# EAGLE schematic ad060 (EAGLE 5.11)
COPYRIGHT: Copyright 2011. All rights reserved.; DOCUMENT: Beat707; REVISION: B

## Sheet 1 of 9
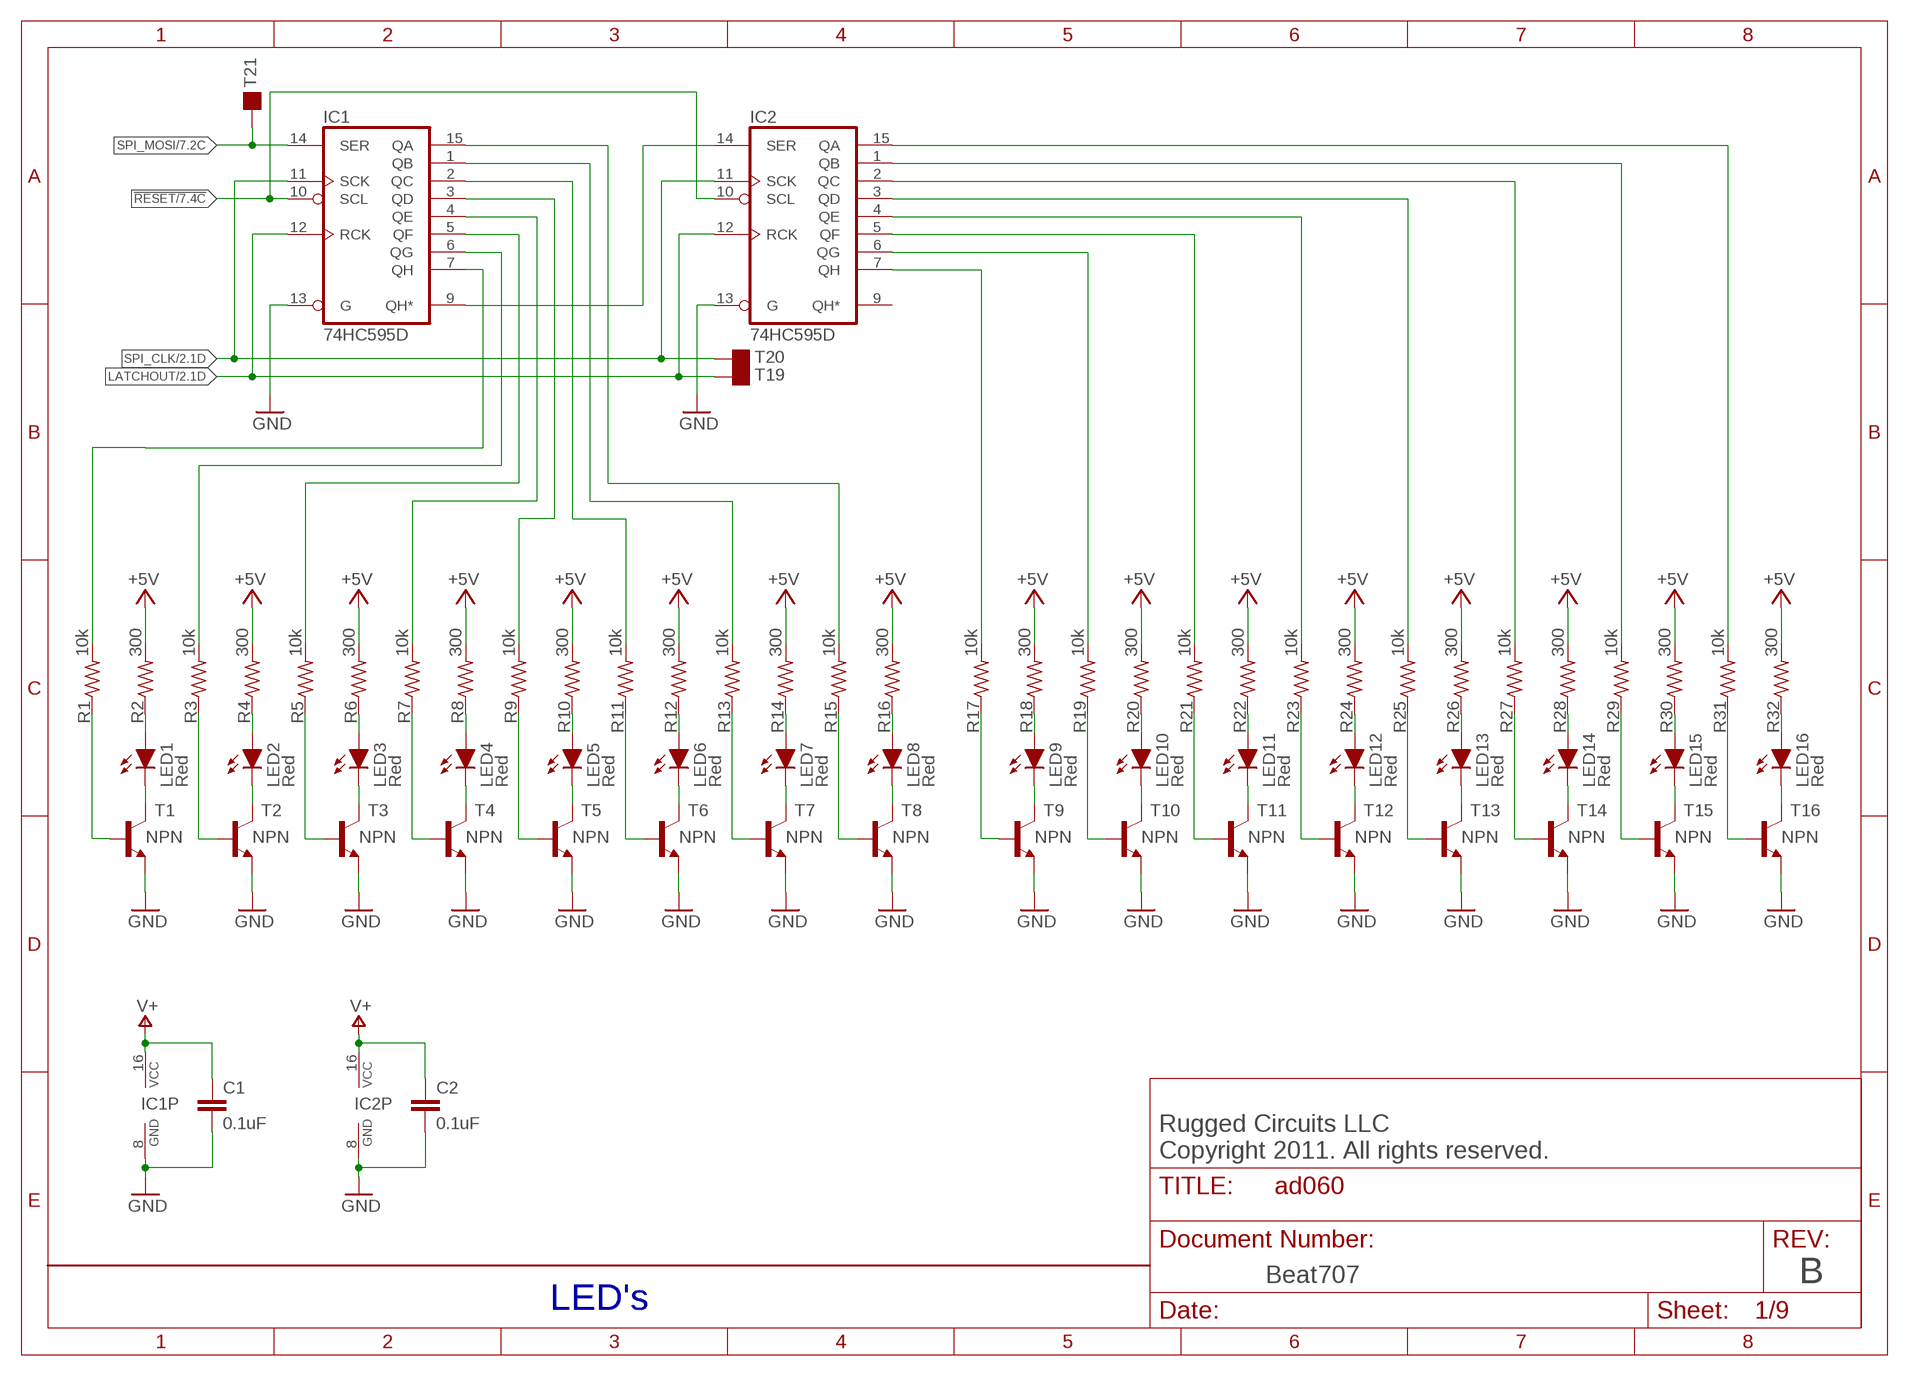
[diagram p0: schematic, sheet 1]

### Parts
C1  0.1uF  C-EUC0805  [C0805]
C2  0.1uF  C-EUC0805  [C0805]
IC1  74HC595D  [SO16]
IC2  74HC595D  [SO16]
LED1  Red  LED1206  [LED1206]
LED2  Red  LED1206  [LED1206]
LED3  Red  LED1206  [LED1206]
LED4  Red  LED1206  [LED1206]
LED5  Red  LED1206  [LED1206]
LED6  Red  LED1206  [LED1206]
LED7  Red  LED1206  [LED1206]
LED8  Red  LED1206  [LED1206]
LED9  Red  LED1206  [LED1206]
LED10  Red  LED1206  [LED1206]
LED11  Red  LED1206  [LED1206]
LED12  Red  LED1206  [LED1206]
LED13  Red  LED1206  [LED1206]
LED14  Red  LED1206  [LED1206]
LED15  Red  LED1206  [LED1206]
LED16  Red  LED1206  [LED1206]
R1  10k  R-US_R0805  [R0805]
R2  300  R-US_R0805  [R0805]
R3  10k  R-US_R0805  [R0805]
R4  300  R-US_R0805  [R0805]
R5  10k  R-US_R0805  [R0805]
R6  300  R-US_R0805  [R0805]
R7  10k  R-US_R0805  [R0805]
R8  300  R-US_R0805  [R0805]
R9  10k  R-US_R0805  [R0805]
R10  300  R-US_R0805  [R0805]
R11  10k  R-US_R0805  [R0805]
R12  300  R-US_R0805  [R0805]
R13  10k  R-US_R0805  [R0805]
R14  300  R-US_R0805  [R0805]
R15  10k  R-US_R0805  [R0805]
R16  300  R-US_R0805  [R0805]
R17  10k  R-US_R0805  [R0805]
R18  300  R-US_R0805  [R0805]
R19  10k  R-US_R0805  [R0805]
R20  300  R-US_R0805  [R0805]
R21  10k  R-US_R0805  [R0805]
R22  300  R-US_R0805  [R0805]
R23  10k  R-US_R0805  [R0805]
R24  300  R-US_R0805  [R0805]
R25  10k  R-US_R0805  [R0805]
R26  300  R-US_R0805  [R0805]
R27  10k  R-US_R0805  [R0805]
R28  300  R-US_R0805  [R0805]
R29  10k  R-US_R0805  [R0805]
R30  300  R-US_R0805  [R0805]
R31  10k  R-US_R0805  [R0805]
R32  300  R-US_R0805  [R0805]
T1  NPN  MMBT4401LT1-NPN-SOT23-BEC  [SOT23-BEC]
T2  NPN  MMBT4401LT1-NPN-SOT23-BEC  [SOT23-BEC]
T3  NPN  MMBT4401LT1-NPN-SOT23-BEC  [SOT23-BEC]
T4  NPN  MMBT4401LT1-NPN-SOT23-BEC  [SOT23-BEC]
T5  NPN  MMBT4401LT1-NPN-SOT23-BEC  [SOT23-BEC]
T6  NPN  MMBT4401LT1-NPN-SOT23-BEC  [SOT23-BEC]
T7  NPN  MMBT4401LT1-NPN-SOT23-BEC  [SOT23-BEC]
T8  NPN  MMBT4401LT1-NPN-SOT23-BEC  [SOT23-BEC]
T9  NPN  MMBT4401LT1-NPN-SOT23-BEC  [SOT23-BEC]
T10  NPN  MMBT4401LT1-NPN-SOT23-BEC  [SOT23-BEC]
T11  NPN  MMBT4401LT1-NPN-SOT23-BEC  [SOT23-BEC]
T12  NPN  MMBT4401LT1-NPN-SOT23-BEC  [SOT23-BEC]
T13  NPN  MMBT4401LT1-NPN-SOT23-BEC  [SOT23-BEC]
T14  NPN  MMBT4401LT1-NPN-SOT23-BEC  [SOT23-BEC]
T15  NPN  MMBT4401LT1-NPN-SOT23-BEC  [SOT23-BEC]
T16  NPN  MMBT4401LT1-NPN-SOT23-BEC  [SOT23-BEC]
T19  TESTPOINT40  [TP40MIL]
T20  TESTPOINT40  [TP40MIL]
T21  TESTPOINT40  [TP40MIL]

### Nets
!RESET: IC1.10(SCL) IC2.10(SCL) ; also sheet 7,9
+5V: R2.2 R4.2 R6.2 R8.2 R10.2 R12.2 R14.2 R16.2 R18.2 R20.2 R22.2 R24.2 R26.2 R28.2 R30.2 R32.2 ; also sheet 5,7,9
GND: C1.2 C2.2 IC1.8(GND) IC1.13(G) IC2.8(GND) IC2.13(G) T1.E T2.E T3.E T4.E T5.E T6.E T7.E T8.E T9.E T10.E T11.E T12.E T13.E T14.E T15.E T16.E ; also sheet 2,3,4,5,6,7,8,9
LATCHOUT: IC1.12(RCK) IC2.12(RCK) T19.1 ; also sheet 2,3,9
N$1: IC1.9(QH*) IC2.14(SER)
N$3: LED1.A R2.1
N$4: LED1.K T1.C
N$5: LED2.A R4.1
N$6: LED2.K T2.C
N$7: IC1.7(QH) R1.2
N$8: IC1.6(QG) R3.2
N$9: R3.1 T2.B
N$12: R1.1 T1.B
N$14: LED3.A R6.1
N$31: LED3.K T3.C
N$32: R5.1 T3.B
N$38: LED4.A R8.1
N$39: LED4.K T4.C
N$40: R7.1 T4.B
N$55: LED5.A R10.1
N$56: LED5.K T5.C
N$57: R9.1 T5.B
N$58: LED6.A R12.1
N$59: LED6.K T6.C
N$60: R11.1 T6.B
N$61: LED7.A R14.1
N$62: LED7.K T7.C
N$63: R13.1 T7.B
N$64: LED8.A R16.1
N$65: LED8.K T8.C
N$66: R15.1 T8.B
N$67: LED9.A R18.1
N$68: LED9.K T9.C
N$69: LED10.A R20.1
N$70: LED10.K T10.C
N$71: R17.1 T9.B
N$72: R19.1 T10.B
N$73: LED11.A R22.1
N$74: LED11.K T11.C
N$75: R21.1 T11.B
N$76: LED12.A R24.1
N$77: LED12.K T12.C
N$78: R23.1 T12.B
N$79: LED13.A R26.1
N$80: LED13.K T13.C
N$81: R25.1 T13.B
N$82: LED14.A R28.1
N$83: LED14.K T14.C
N$84: R27.1 T14.B
N$85: LED15.A R30.1
N$86: LED15.K T15.C
N$87: R29.1 T15.B
N$88: LED16.A R32.1
N$89: LED16.K T16.C
N$90: R31.1 T16.B
N$91: IC1.5(QF) R5.2
N$92: IC1.4(QE) R7.2
N$93: IC1.3(QD) R9.2
N$94: IC1.2(QC) R11.2
N$95: IC1.1(QB) R13.2
N$96: IC1.15(QA) R15.2
N$97: IC2.7(QH) R17.2
N$98: IC2.6(QG) R19.2
N$99: IC2.5(QF) R21.2
N$100: IC2.4(QE) R23.2
N$101: IC2.3(QD) R25.2
N$102: IC2.2(QC) R27.2
N$103: IC2.1(QB) R29.2
N$104: IC2.15(QA) R31.2
SPI_CLK: IC1.11(SCK) IC2.11(SCK) T20.1 ; also sheet 2,3,7,8,9
SPI_MOSI: IC1.14(SER) T21.1 ; also sheet 7,8,9
V+: C1.1 C2.1 IC1.16(VCC) IC2.16(VCC) ; also sheet 2,3,4,6,7,8,9
Unconnected: IC2.9(QH*)

### Notes on the sheet
- Rugged Circuits LLC
- LED's

## Sheet 2 of 9
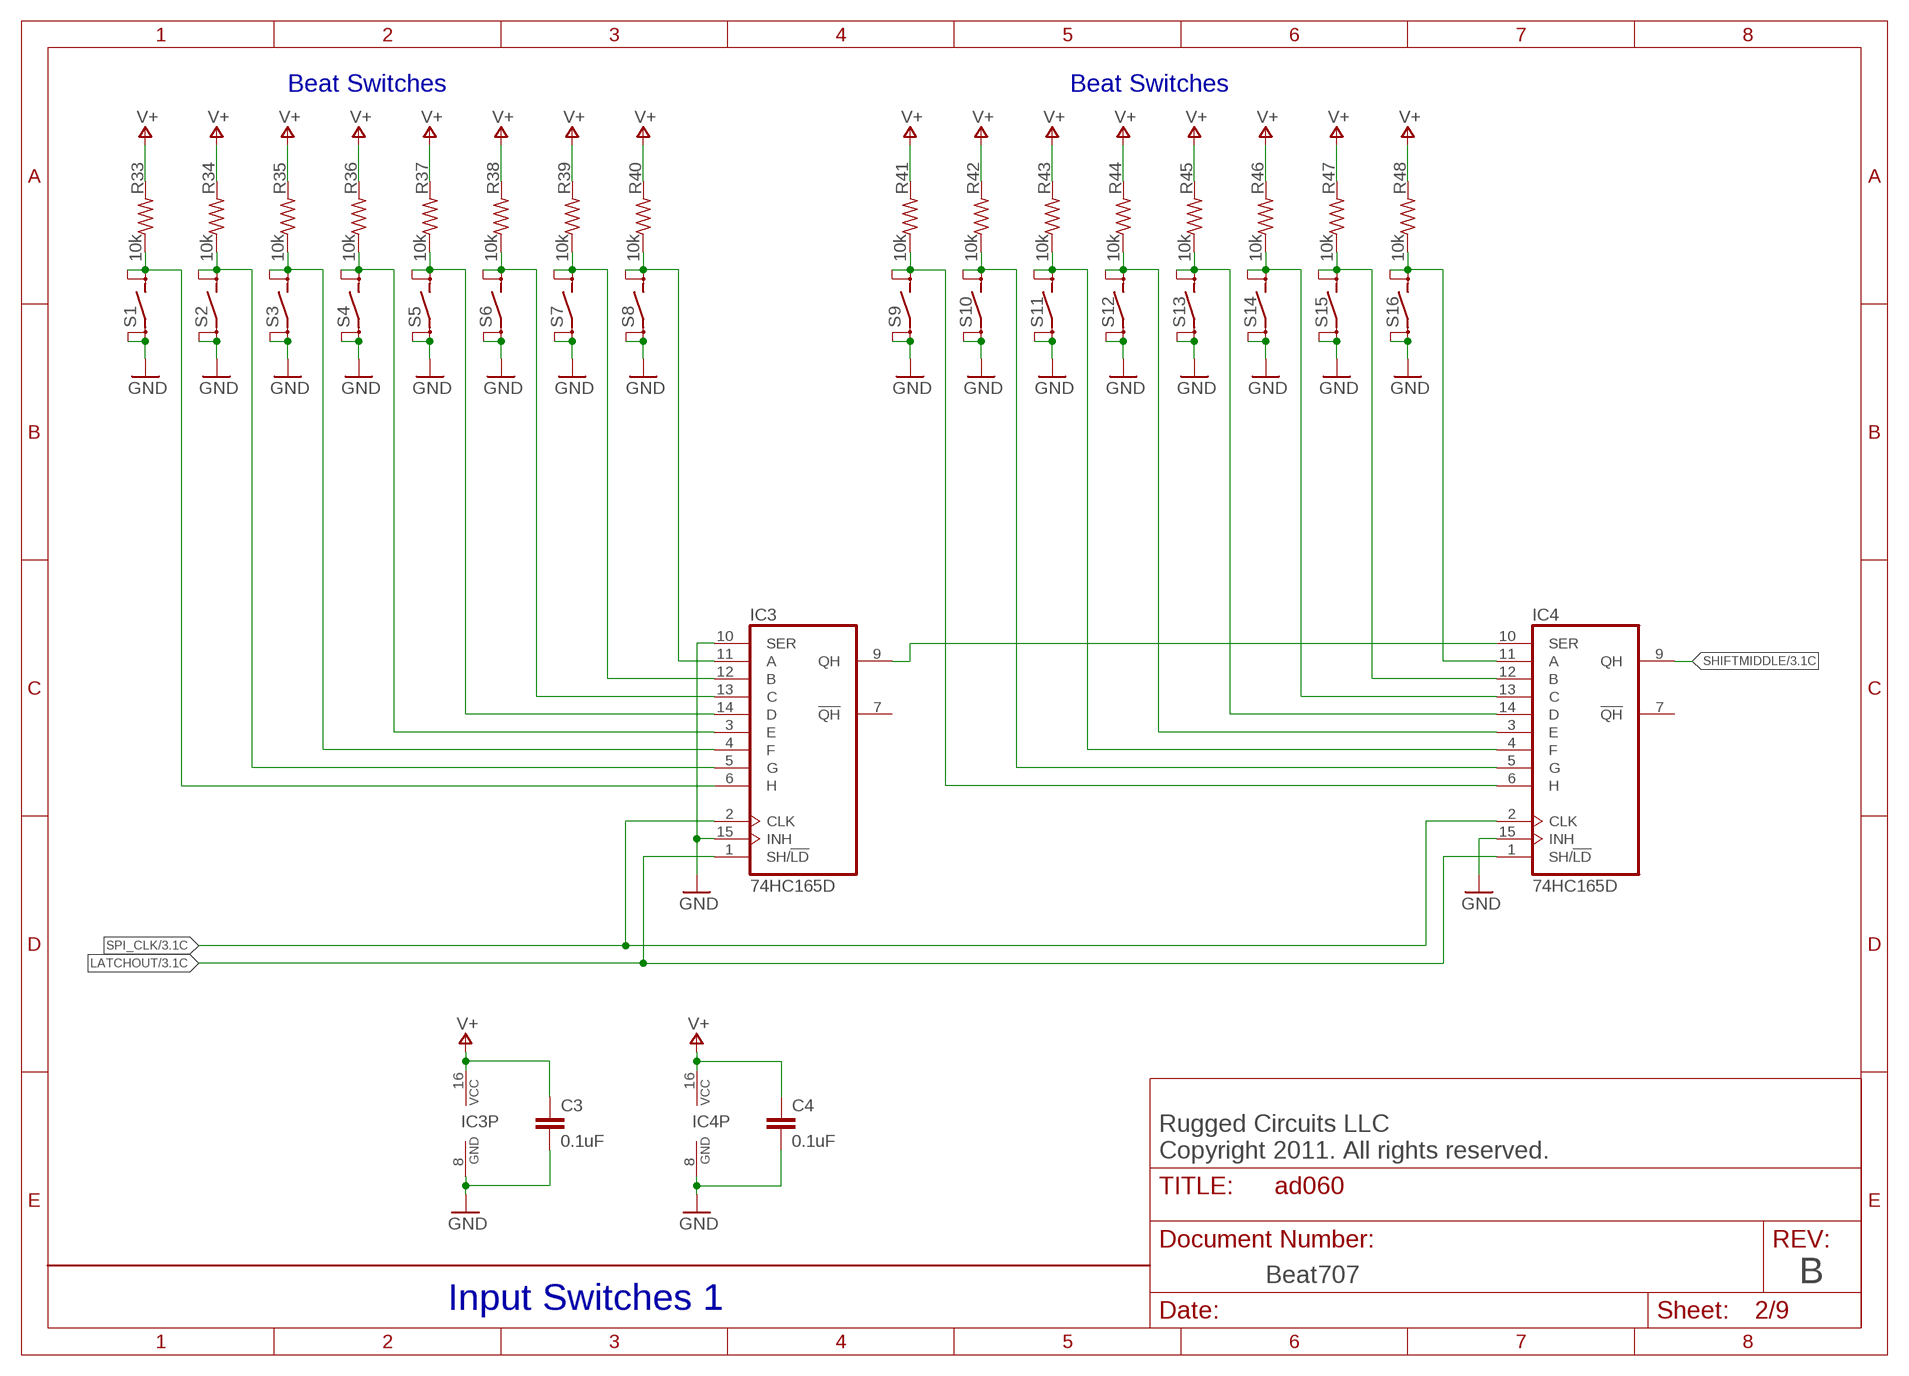
[diagram p1: schematic, sheet 2]

### Parts
C3  0.1uF  C-EUC0805  [C0805]
C4  0.1uF  C-EUC0805  [C0805]
IC3  74HC165D  [SO16]
IC4  74HC165D  [SO16]
R33  10k  R-US_R0805  [R0805]
R34  10k  R-US_R0805  [R0805]
R35  10k  R-US_R0805  [R0805]
R36  10k  R-US_R0805  [R0805]
R37  10k  R-US_R0805  [R0805]
R38  10k  R-US_R0805  [R0805]
R39  10k  R-US_R0805  [R0805]
R40  10k  R-US_R0805  [R0805]
R41  10k  R-US_R0805  [R0805]
R42  10k  R-US_R0805  [R0805]
R43  10k  R-US_R0805  [R0805]
R44  10k  R-US_R0805  [R0805]
R45  10k  R-US_R0805  [R0805]
R46  10k  R-US_R0805  [R0805]
R47  10k  R-US_R0805  [R0805]
R48  10k  R-US_R0805  [R0805]
S1  SPST2CONTACTTL1100F160Q  [TL1100F160Q]
S2  SPST2CONTACTTL1100F160Q  [TL1100F160Q]
S3  SPST2CONTACTTL1100F160Q  [TL1100F160Q]
S4  SPST2CONTACTTL1100F160Q  [TL1100F160Q]
S5  SPST2CONTACTTL1100F160Q  [TL1100F160Q]
S6  SPST2CONTACTTL1100F160Q  [TL1100F160Q]
S7  SPST2CONTACTTL1100F160Q  [TL1100F160Q]
S8  SPST2CONTACTTL1100F160Q  [TL1100F160Q]
S9  SPST2CONTACTTL1100F160Q  [TL1100F160Q]
S10  SPST2CONTACTTL1100F160Q  [TL1100F160Q]
S11  SPST2CONTACTTL1100F160Q  [TL1100F160Q]
S12  SPST2CONTACTTL1100F160Q  [TL1100F160Q]
S13  SPST2CONTACTTL1100F160Q  [TL1100F160Q]
S14  SPST2CONTACTTL1100F160Q  [TL1100F160Q]
S15  SPST2CONTACTTL1100F160Q  [TL1100F160Q]
S16  SPST2CONTACTTL1100F160Q  [TL1100F160Q]

### Nets
GND: C3.2 C4.2 IC3.8(GND) IC3.10(SER) IC3.15(INH) IC4.8(GND) IC4.15(INH) S1.1(A1) S1.2(A2) S2.1(A1) S2.2(A2) S3.1(A1) S3.2(A2) S4.1(A1) S4.2(A2) S5.1(A1) S5.2(A2) S6.1(A1) S6.2(A2) S7.1(A1) S7.2(A2) S8.1(A1) S8.2(A2) S9.1(A1) S9.2(A2) S10.1(A1) S10.2(A2) S11.1(A1) S11.2(A2) S12.1(A1) S12.2(A2) S13.1(A1) S13.2(A2) S14.1(A1) S14.2(A2) S15.1(A1) S15.2(A2) S16.1(A1) S16.2(A2) ; also sheet 1,3,4,5,6,7,8,9
LATCHOUT: IC3.1(SH/!LD) IC4.1(SH/!LD) ; also sheet 1,3,9
N$16: IC3.9(QH) IC4.10(SER)
N$22: IC3.6(H) R33.1 S1.3(B1) S1.4(B2)
N$24: IC3.5(G) R34.1 S2.3(B1) S2.4(B2)
N$26: IC3.4(F) R35.1 S3.3(B1) S3.4(B2)
N$28: IC3.3(E) R36.1 S4.3(B1) S4.4(B2)
N$30: IC3.14(D) R37.1 S5.3(B1) S5.4(B2)
N$33: IC3.13(C) R38.1 S6.3(B1) S6.4(B2)
N$34: IC3.12(B) R39.1 S7.3(B1) S7.4(B2)
N$35: IC4.6(H) R41.1 S9.3(B1) S9.4(B2)
N$36: IC4.5(G) R42.1 S10.3(B1) S10.4(B2)
N$43: IC4.4(F) R43.1 S11.3(B1) S11.4(B2)
N$44: IC3.11(A) R40.1 S8.3(B1) S8.4(B2)
N$45: IC4.3(E) R44.1 S12.3(B1) S12.4(B2)
N$46: IC4.14(D) R45.1 S13.3(B1) S13.4(B2)
N$47: IC4.13(C) R46.1 S14.3(B1) S14.4(B2)
N$48: IC4.12(B) R47.1 S15.3(B1) S15.4(B2)
N$49: IC4.11(A) R48.1 S16.3(B1) S16.4(B2)
SHIFTMIDDLE: IC4.9(QH) ; also sheet 3
SPI_CLK: IC3.2(CLK) IC4.2(CLK) ; also sheet 1,3,7,8,9
V+: C3.1 C4.1 IC3.16(VCC) IC4.16(VCC) R33.2 R34.2 R35.2 R36.2 R37.2 R38.2 R39.2 R40.2 R41.2 R42.2 R43.2 R44.2 R45.2 R46.2 R47.2 R48.2 ; also sheet 1,3,4,6,7,8,9
Unconnected: IC3.7(!QH) IC4.7(!QH)

### Notes on the sheet
- Beat Switches | Beat Switches
- Rugged Circuits LLC
- Input Switches 1

## Sheet 3 of 9
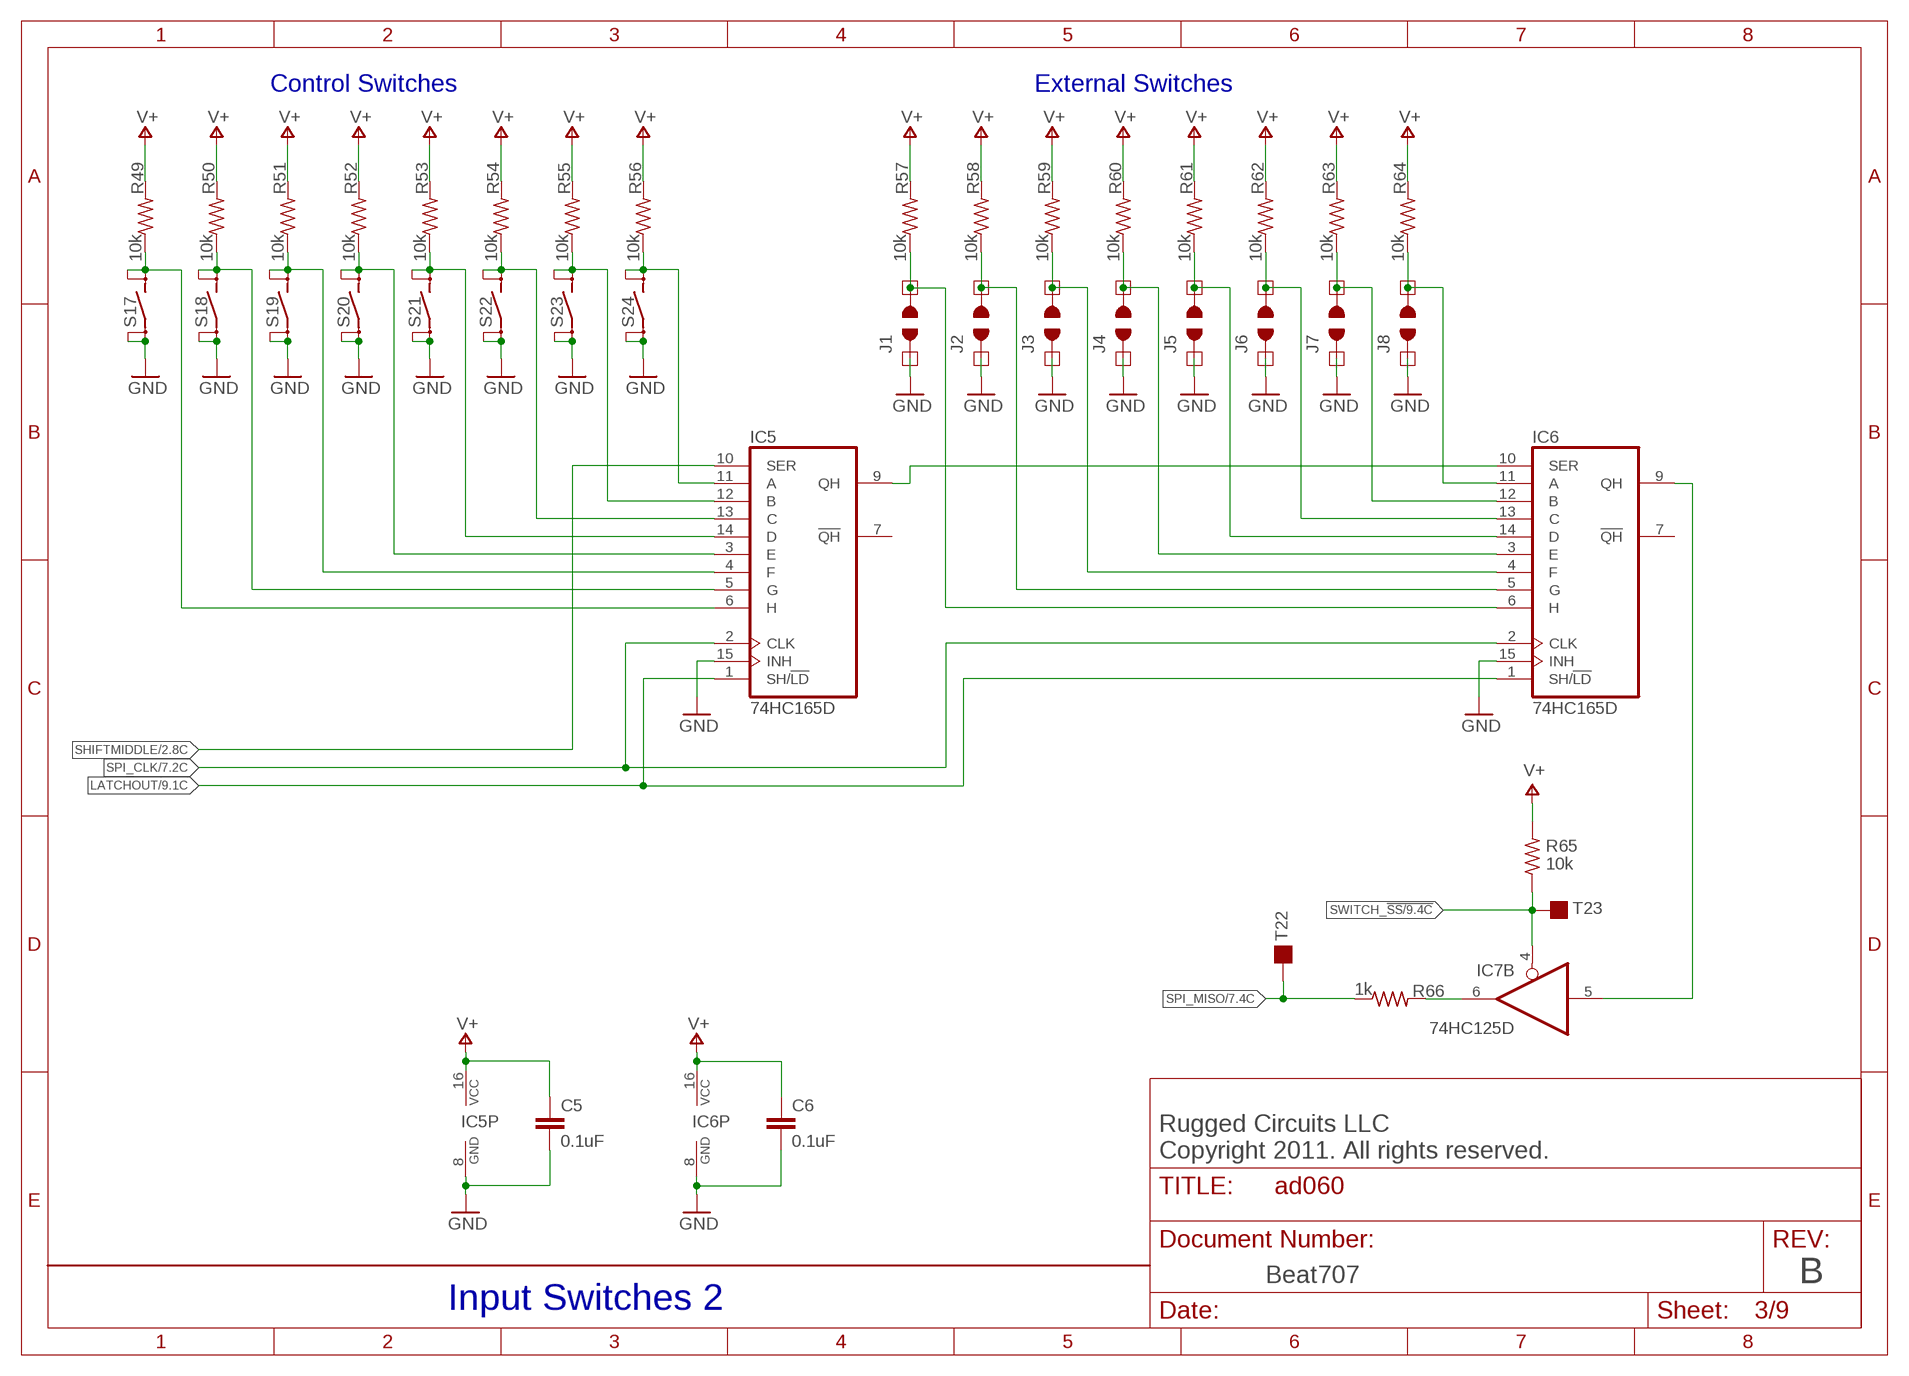
[diagram p2: schematic, sheet 3]

### Parts
C5  0.1uF  C-EUC0805  [C0805]
C6  0.1uF  C-EUC0805  [C0805]
IC5  74HC165D  [SO16]
IC6  74HC165D  [SO16]
IC7  74HC125D  [SO14]
J1  JP2NO  [JP2NO]
J2  JP2NO  [JP2NO]
J3  JP2NO  [JP2NO]
J4  JP2NO  [JP2NO]
J5  JP2NO  [JP2NO]
J6  JP2NO  [JP2NO]
J7  JP2NO  [JP2NO]
J8  JP2NO  [JP2NO]
R49  10k  R-US_R0805  [R0805]
R50  10k  R-US_R0805  [R0805]
R51  10k  R-US_R0805  [R0805]
R52  10k  R-US_R0805  [R0805]
R53  10k  R-US_R0805  [R0805]
R54  10k  R-US_R0805  [R0805]
R55  10k  R-US_R0805  [R0805]
R56  10k  R-US_R0805  [R0805]
R57  10k  R-US_R0805  [R0805]
R58  10k  R-US_R0805  [R0805]
R59  10k  R-US_R0805  [R0805]
R60  10k  R-US_R0805  [R0805]
R61  10k  R-US_R0805  [R0805]
R62  10k  R-US_R0805  [R0805]
R63  10k  R-US_R0805  [R0805]
R64  10k  R-US_R0805  [R0805]
R65  10k  R-US_R0805  [R0805]
R66  1k  R-US_R0805  [R0805]
S17  SPST2CONTACTTL1100F160Q  [TL1100F160Q]
S18  SPST2CONTACTTL1100F160Q  [TL1100F160Q]
S19  SPST2CONTACTTL1100F160Q  [TL1100F160Q]
S20  SPST2CONTACTTL1100F160Q  [TL1100F160Q]
S21  SPST2CONTACTTL1100F160Q  [TL1100F160Q]
S22  SPST2CONTACTTL1100F160Q  [TL1100F160Q]
S23  SPST2CONTACTTL1100F160Q  [TL1100F160Q]
S24  SPST2CONTACTTL1100F160Q  [TL1100F160Q]
T22  TESTPOINT40  [TP40MIL]
T23  TESTPOINT40  [TP40MIL]

### Nets
GND: C5.2 C6.2 IC5.8(GND) IC5.15(INH) IC6.8(GND) IC6.15(INH) J1.1 J2.1 J3.1 J4.1 J5.1 J6.1 J7.1 J8.1 S17.1(A1) S17.2(A2) S18.1(A1) S18.2(A2) S19.1(A1) S19.2(A2) S20.1(A1) S20.2(A2) S21.1(A1) S21.2(A2) S22.1(A1) S22.2(A2) S23.1(A1) S23.2(A2) S24.1(A1) S24.2(A2) ; also sheet 1,2,4,5,6,7,8,9
LATCHOUT: IC5.1(SH/!LD) IC6.1(SH/!LD) ; also sheet 1,2,9
N$17: IC5.9(QH) IC6.10(SER)
N$20: IC5.6(H) R49.1 S17.3(B1) S17.4(B2)
N$50: IC5.5(G) R50.1 S18.3(B1) S18.4(B2)
N$51: IC5.4(F) R51.1 S19.3(B1) S19.4(B2)
N$52: IC5.3(E) R52.1 S20.3(B1) S20.4(B2)
N$53: IC5.14(D) R53.1 S21.3(B1) S21.4(B2)
N$54: IC5.13(C) R54.1 S22.3(B1) S22.4(B2)
N$105: IC5.12(B) R55.1 S23.3(B1) S23.4(B2)
N$106: IC5.11(A) R56.1 S24.3(B1) S24.4(B2)
N$107: IC6.6(H) J1.2 R57.1
N$108: IC6.5(G) J2.2 R58.1
N$109: IC6.4(F) J3.2 R59.1
N$110: IC6.3(E) J4.2 R60.1
N$111: IC6.14(D) J5.2 R61.1
N$112: IC6.13(C) J6.2 R62.1
N$113: IC6.12(B) J7.2 R63.1
N$114: IC6.11(A) J8.2 R64.1
N$158: IC7.6(B:O) R66.2
N$159: IC6.9(QH) IC7.5(B:I)
SHIFTMIDDLE: IC5.10(SER) ; also sheet 2
SPI_CLK: IC5.2(CLK) IC6.2(CLK) ; also sheet 1,2,7,8,9
SPI_MISO: R66.1 T22.1 ; also sheet 7,8,9
SWITCH_!SS: IC7.4(B:OE) R65.1 T23.1 ; also sheet 9
V+: C5.1 C6.1 IC5.16(VCC) IC6.16(VCC) R49.2 R50.2 R51.2 R52.2 R53.2 R54.2 R55.2 R56.2 R57.2 R58.2 R59.2 R60.2 R61.2 R62.2 R63.2 R64.2 R65.2 ; also sheet 1,2,4,6,7,8,9
Unconnected: IC5.7(!QH) IC6.7(!QH)

### Notes on the sheet
- Control Switches | External Switches
- Rugged Circuits LLC
- Input Switches 2

## Sheet 4 of 9
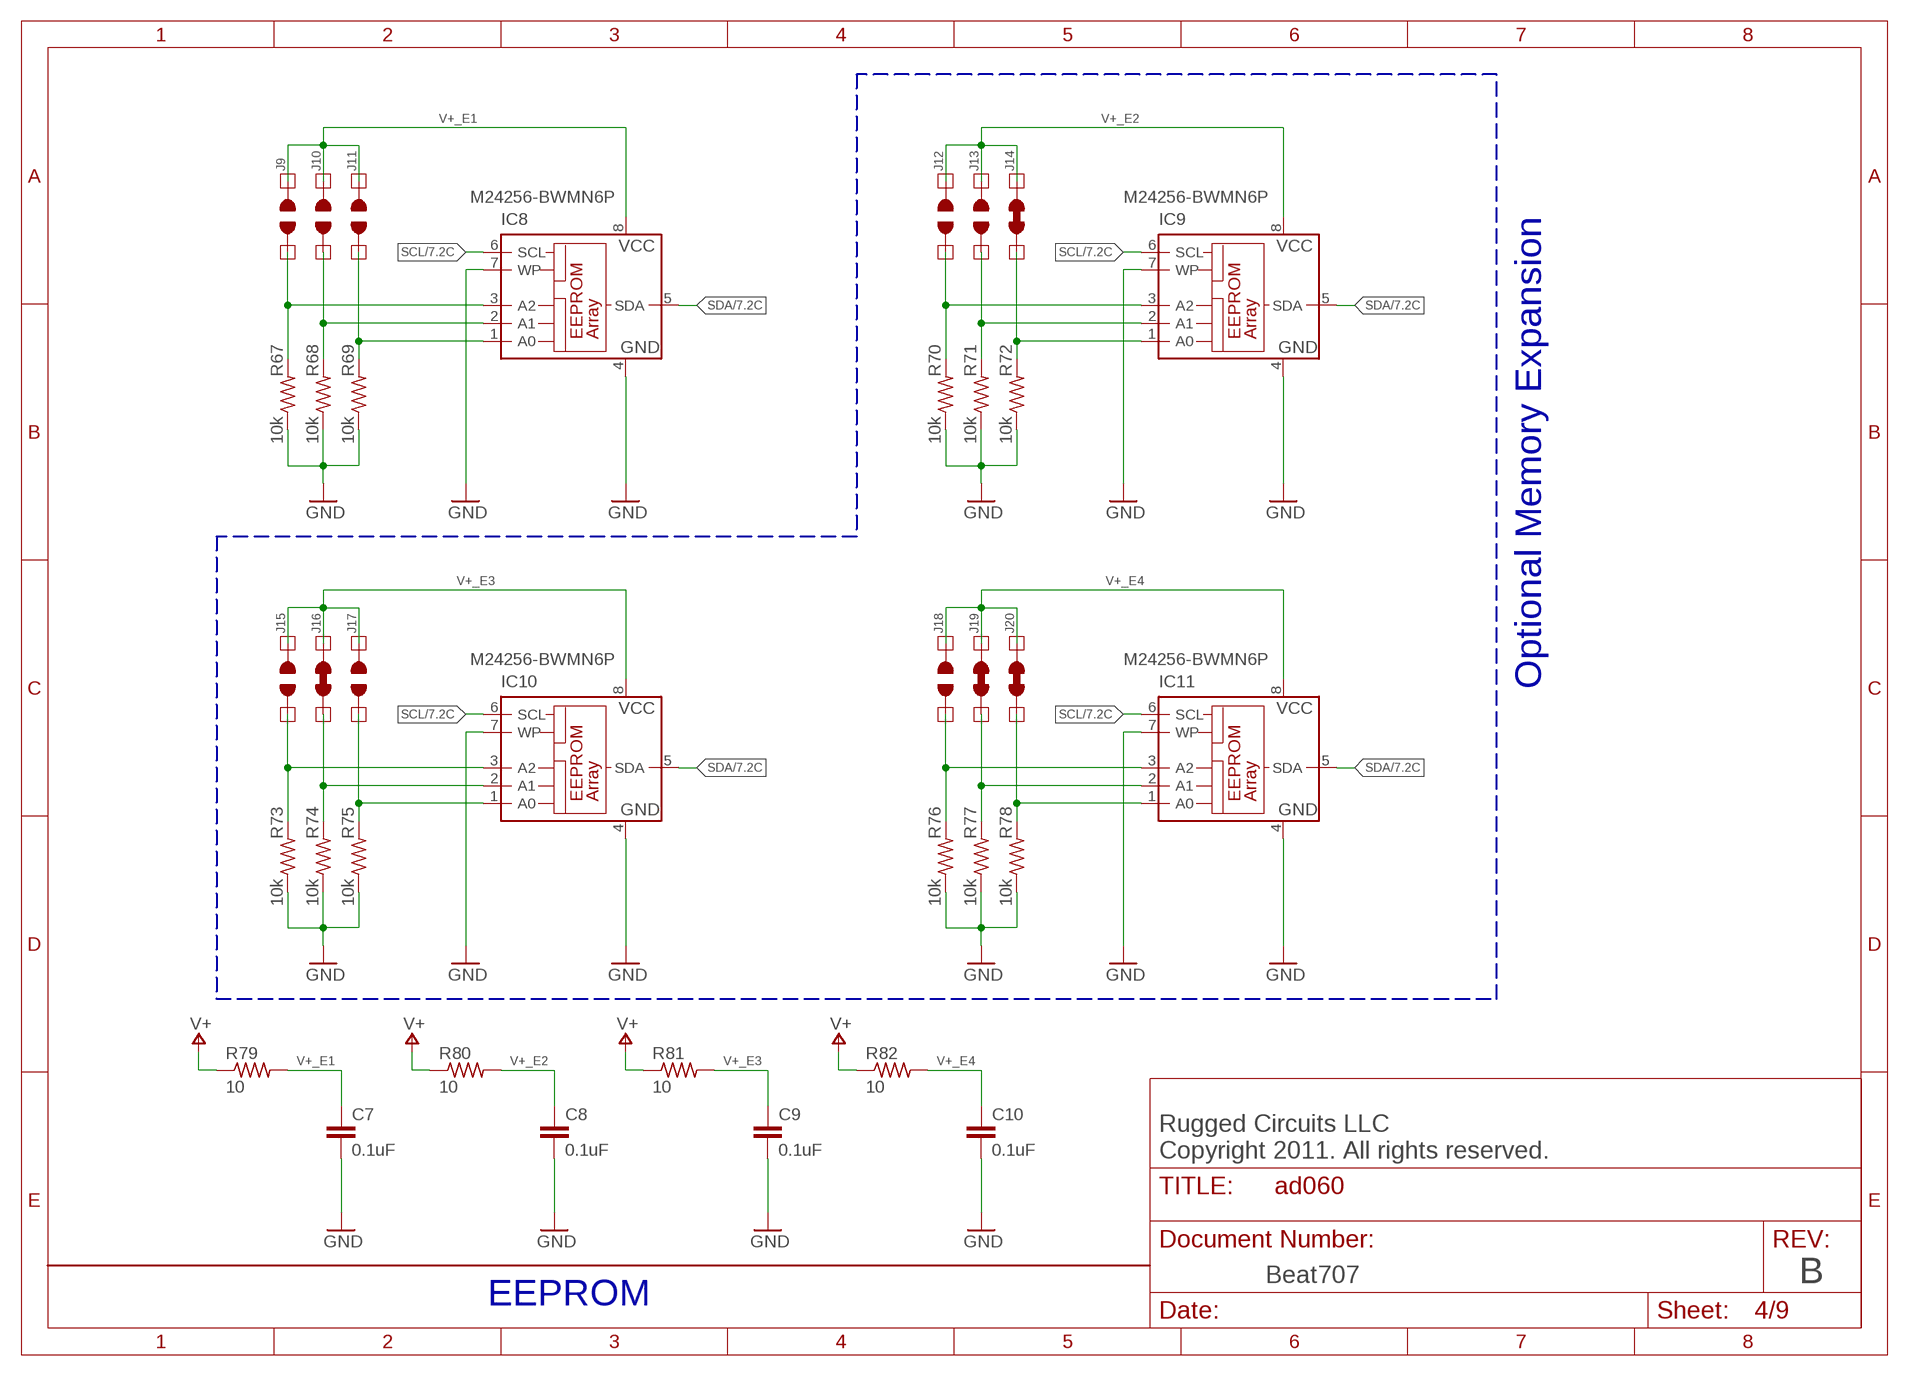
[diagram p3: schematic, sheet 4]

### Parts
C7  0.1uF  C-EUC0805  [C0805]
C8  0.1uF  C-EUC0805  [C0805]
C9  0.1uF  C-EUC0805  [C0805]
C10  0.1uF  C-EUC0805  [C0805]
IC8  M24256-BWMN6P  24LC256SN  [SO-08]
IC9  M24256-BWMN6P  24LC256SN  [SO-08]
IC10  M24256-BWMN6P  24LC256SN  [SO-08]
IC11  M24256-BWMN6P  24LC256SN  [SO-08]
J9  JP2NO  [JP2NO]
J10  JP2NO  [JP2NO]
J11  JP2NO  [JP2NO]
J12  JP2NO  [JP2NO]
J13  JP2NO  [JP2NO]
J14  JP2NC  [JP2NC]
J15  JP2NO  [JP2NO]
J16  JP2NC  [JP2NC]
J17  JP2NO  [JP2NO]
J18  JP2NO  [JP2NO]
J19  JP2NC  [JP2NC]
J20  JP2NC  [JP2NC]
R67  10k  R-US_R0805  [R0805]
R68  10k  R-US_R0805  [R0805]
R69  10k  R-US_R0805  [R0805]
R70  10k  R-US_R0805  [R0805]
R71  10k  R-US_R0805  [R0805]
R72  10k  R-US_R0805  [R0805]
R73  10k  R-US_R0805  [R0805]
R74  10k  R-US_R0805  [R0805]
R75  10k  R-US_R0805  [R0805]
R76  10k  R-US_R0805  [R0805]
R77  10k  R-US_R0805  [R0805]
R78  10k  R-US_R0805  [R0805]
R79  10  R-US_R0805  [R0805]
R80  10  R-US_R0805  [R0805]
R81  10  R-US_R0805  [R0805]
R82  10  R-US_R0805  [R0805]

### Nets
GND: C7.2 C8.2 C9.2 C10.2 IC8.4(GND) IC8.7(WP) IC9.4(GND) IC9.7(WP) IC10.4(GND) IC10.7(WP) IC11.4(GND) IC11.7(WP) R67.1 R68.1 R69.1 R70.1 R71.1 R72.1 R73.1 R74.1 R75.1 R76.1 R77.1 R78.1 ; also sheet 1,2,3,5,6,7,8,9
N$37: IC8.1(A0) J11.1 R69.2
N$41: IC8.2(A1) J10.1 R68.2
N$42: IC8.3(A2) J9.1 R67.2
N$118: IC9.1(A0) J14.1 R72.2
N$119: IC9.2(A1) J13.1 R71.2
N$120: IC9.3(A2) J12.1 R70.2
N$121: IC10.1(A0) J17.1 R75.2
N$122: IC10.2(A1) J16.1 R74.2
N$123: IC10.3(A2) J15.1 R73.2
N$124: IC11.1(A0) J20.1 R78.2
N$125: IC11.2(A1) J19.1 R77.2
N$126: IC11.3(A2) J18.1 R76.2
SCL: IC8.6(SCL) IC9.6(SCL) IC10.6(SCL) IC11.6(SCL) ; also sheet 7,9
SDA: IC8.5(SDA) IC9.5(SDA) IC10.5(SDA) IC11.5(SDA) ; also sheet 7,9
V+: R79.1 R80.1 R81.1 R82.1 ; also sheet 1,2,3,6,7,8,9
V+_E1: C7.1 IC8.8(VCC) J9.2 J10.2 J11.2 R79.2
V+_E2: C8.1 IC9.8(VCC) J12.2 J13.2 J14.2 R80.2
V+_E3: C9.1 IC10.8(VCC) J15.2 J16.2 J17.2 R81.2
V+_E4: C10.1 IC11.8(VCC) J18.2 J19.2 J20.2 R82.2

### Notes on the sheet
- Optional Memory Expansion
- Rugged Circuits LLC
- EEPROM

## Sheet 5 of 9
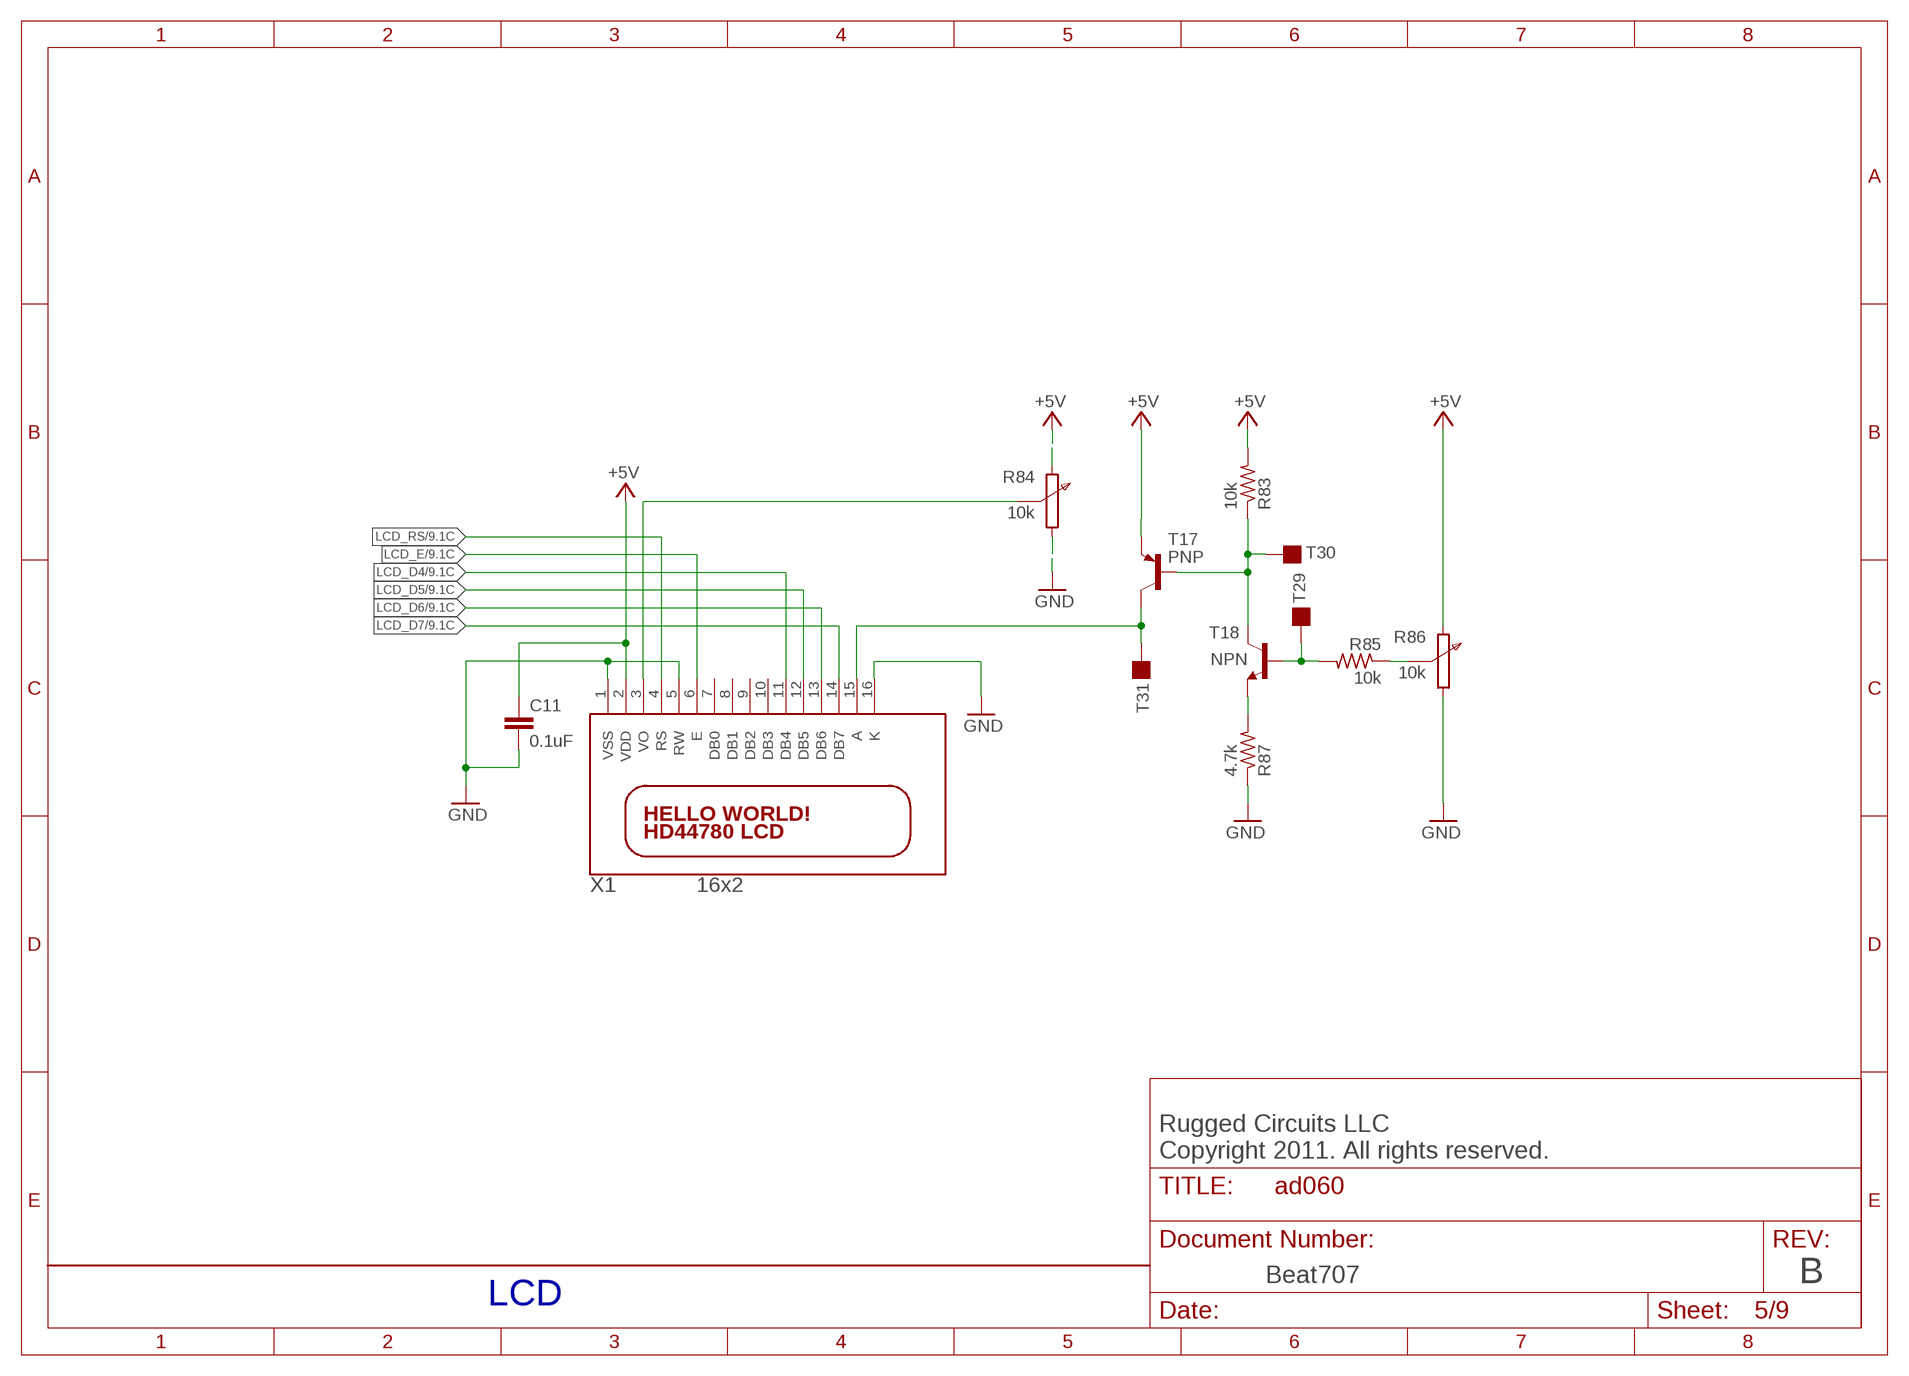
[diagram p4: schematic, sheet 5]

### Parts
C11  0.1uF  C-EUC0805  [C0805]
R83  10k  R-US_R0805  [R0805]
R84  10k  POTEVND8A  [EVND8A]
R85  10k  R-US_R0805  [R0805]
R86  10k  POTEVND8A  [EVND8A]
R87  4.7k  R-US_R0805  [R0805]
T17  PNP  MMBT2907ALT1-PNP-SOT23-BEC  [SOT23-BEC]
T18  NPN  MMBT4401LT1-NPN-SOT23-BEC  [SOT23-BEC]
T29  TESTPOINT40  [TP40MIL]
T30  TESTPOINT40  [TP40MIL]
T31  TESTPOINT40  [TP40MIL]
X1  16x2  HD44780LCD-1602  [LCD1602]

### Nets
+5V: C11.1 R83.2 R84.3(B) R86.3(B) T17.E X1.2(VDD) ; also sheet 1,7,9
GND: C11.2 R84.1(A) R86.1(A) R87.1 X1.1(VSS) X1.5(RW) X1.16(K) ; also sheet 1,2,3,4,6,7,8,9
LCD_D4: X1.11(DB4) ; also sheet 9
LCD_D5: X1.12(DB5) ; also sheet 9
LCD_D6: X1.13(DB6) ; also sheet 9
LCD_D7: X1.14(DB7) ; also sheet 9
LCD_E: X1.6(E) ; also sheet 9
LCD_RS: X1.4(RS) ; also sheet 9
N$115: R84.2(W) X1.3(VO)
N$117: T17.C T31.1 X1.15(A)
N$127: R83.1 T17.B T18.C T30.1
N$129: R87.2 T18.E
N$130: R85.1 R86.2(W)
N$131: R85.2 T18.B T29.1
Unconnected: X1.7(DB0) X1.8(DB1) X1.9(DB2) X1.10(DB3)

### Notes on the sheet
- Rugged Circuits LLC
- LCD

## Sheet 6 of 9
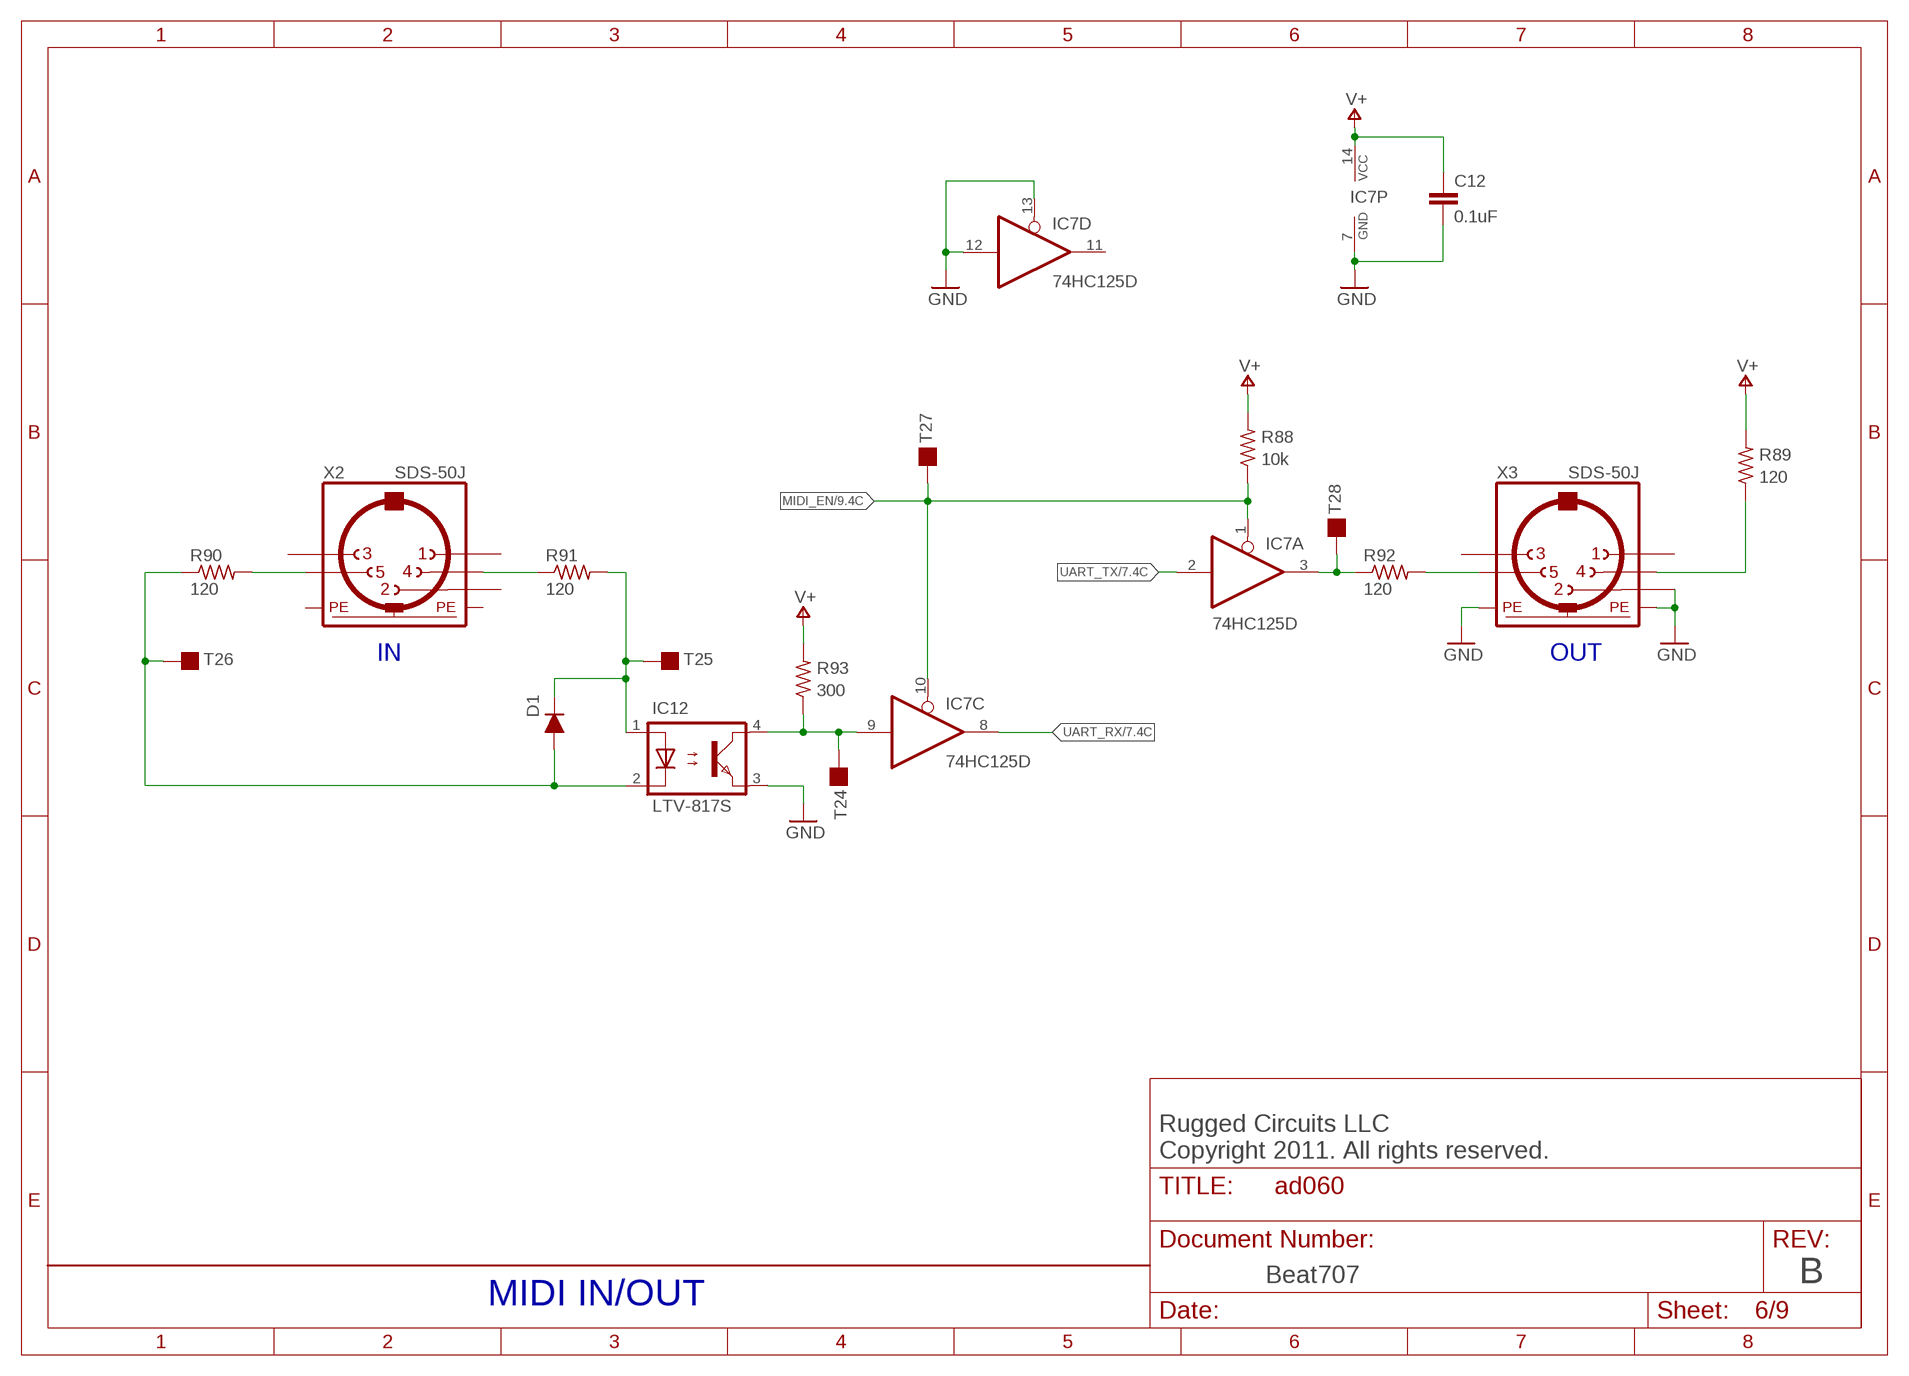
[diagram p5: schematic, sheet 6]

### Parts
C12  0.1uF  C-EUC0805  [C0805]
D1  DIODESOD-123  [SOD-123]
IC12  LTV-817S  OPTOISOLATORLITEON.SMD4  [LITEON.SMD4]
R88  10k  R-US_R0805  [R0805]
R89  120  R-US_R0805  [R0805]
R90  120  R-US_R0805  [R0805]
R91  120  R-US_R0805  [R0805]
R92  120  R-US_R0805  [R0805]
R93  300  R-US_R0805  [R0805]
T24  TESTPOINT40  [TP40MIL]
T25  TESTPOINT40  [TP40MIL]
T26  TESTPOINT40  [TP40MIL]
T27  TESTPOINT40  [TP40MIL]
T28  TESTPOINT40  [TP40MIL]
X2  SDS-50J  [SDS-50J]
X3  SDS-50J  [SDS-50J]

### Nets
GND: C12.2 IC7.7(P:GND) IC7.12(D:I) IC7.13(D:OE) IC12.3(EMITTER) X3.2 X3.PE X3.PE@(PE) ; also sheet 1,2,3,4,5,7,8,9
MIDI_EN: IC7.1(A:OE) IC7.10(C:OE) R88.1 T27.1 ; also sheet 9
N$116: R89.1 X3.4
N$128: R92.2 X3.5
N$135: R91.1 X2.4
N$136: R90.2 X2.5
N$137: D1.K IC12.1(ANODE) R91.2 T25.1
N$138: D1.A IC12.2(CATHODE) R90.1 T26.1
N$153: IC7.3(A:O) R92.1 T28.1
N$155: IC7.9(C:I) IC12.4(COLLECTOR) R93.1 T24.1
UART_RX: IC7.8(C:O) ; also sheet 7,9
UART_TX: IC7.2(A:I) ; also sheet 7,9
V+: C12.1 IC7.14(P:VCC) R88.2 R89.2 R93.2 ; also sheet 1,2,3,4,7,8,9
Unconnected: IC7.11(D:O) X2.1 X2.2 X2.3 X2.PE X2.PE@(PE) X3.1 X3.3

### Notes on the sheet
- IN | OUT
- Rugged Circuits LLC
- MIDI IN/OUT

## Sheet 7 of 9
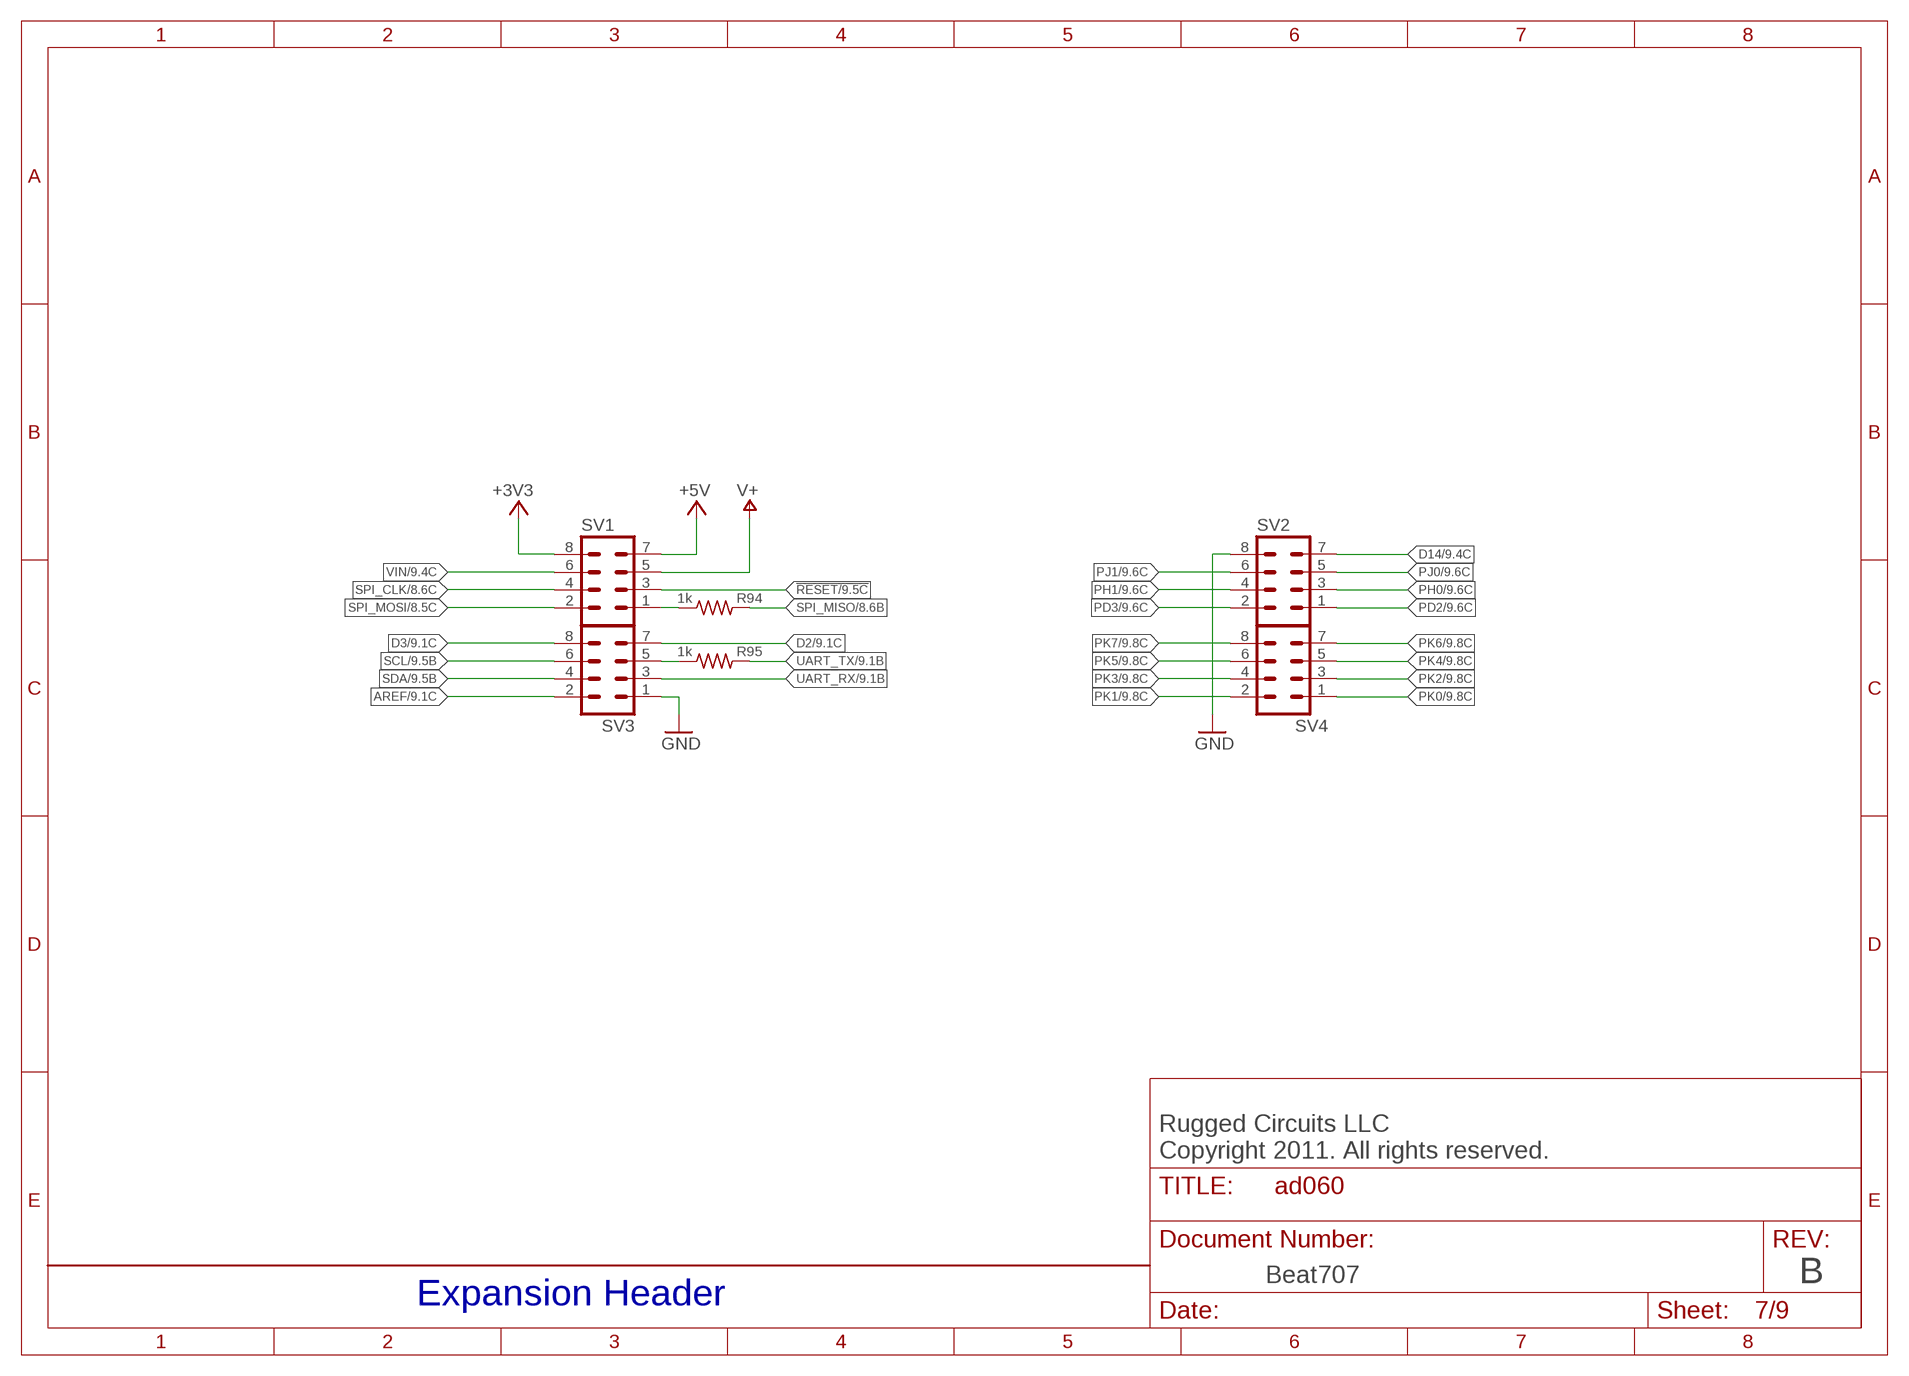
[diagram p6: schematic, sheet 7]

### Parts
R94  1k  R-US_R0805  [R0805]
R95  1k  R-US_R0805  [R0805]
SV1  MA04-2  [MA04-2]
SV2  MA04-2  [MA04-2]
SV3  MA04-2  [MA04-2]
SV4  MA04-2  [MA04-2]

### Nets
!RESET: SV1.3 ; also sheet 1,9
+3V3: SV1.8 ; also sheet 8,9
+5V: SV1.7 ; also sheet 1,5,9
AREF: SV3.2 ; also sheet 9
D2: SV3.7 ; also sheet 9
D3: SV3.8 ; also sheet 9
D14: SV2.7 ; also sheet 9
GND: SV2.8 SV3.1 ; also sheet 1,2,3,4,5,6,8,9
N$151: R95.1 SV3.5
N$156: R94.1 SV1.1
PD2: SV2.1 ; also sheet 9
PD3: SV2.2 ; also sheet 9
PH0: SV2.3 ; also sheet 9
PH1: SV2.4 ; also sheet 9
PJ0: SV2.5 ; also sheet 9
PJ1: SV2.6 ; also sheet 9
PK0: SV4.1 ; also sheet 9
PK1: SV4.2 ; also sheet 9
PK2: SV4.3 ; also sheet 9
PK3: SV4.4 ; also sheet 9
PK4: SV4.5 ; also sheet 9
PK5: SV4.6 ; also sheet 9
PK6: SV4.7 ; also sheet 9
PK7: SV4.8 ; also sheet 9
SCL: SV3.6 ; also sheet 4,9
SDA: SV3.4 ; also sheet 4,9
SPI_CLK: SV1.4 ; also sheet 1,2,3,8,9
SPI_MISO: R94.2 ; also sheet 3,8,9
SPI_MOSI: SV1.2 ; also sheet 1,8,9
UART_RX: SV3.3 ; also sheet 6,9
UART_TX: R95.2 ; also sheet 6,9
V+: SV1.5 ; also sheet 1,2,3,4,6,8,9
VIN: SV1.6 ; also sheet 9

### Notes on the sheet
- Rugged Circuits LLC
- Expansion Header

## Sheet 8 of 9
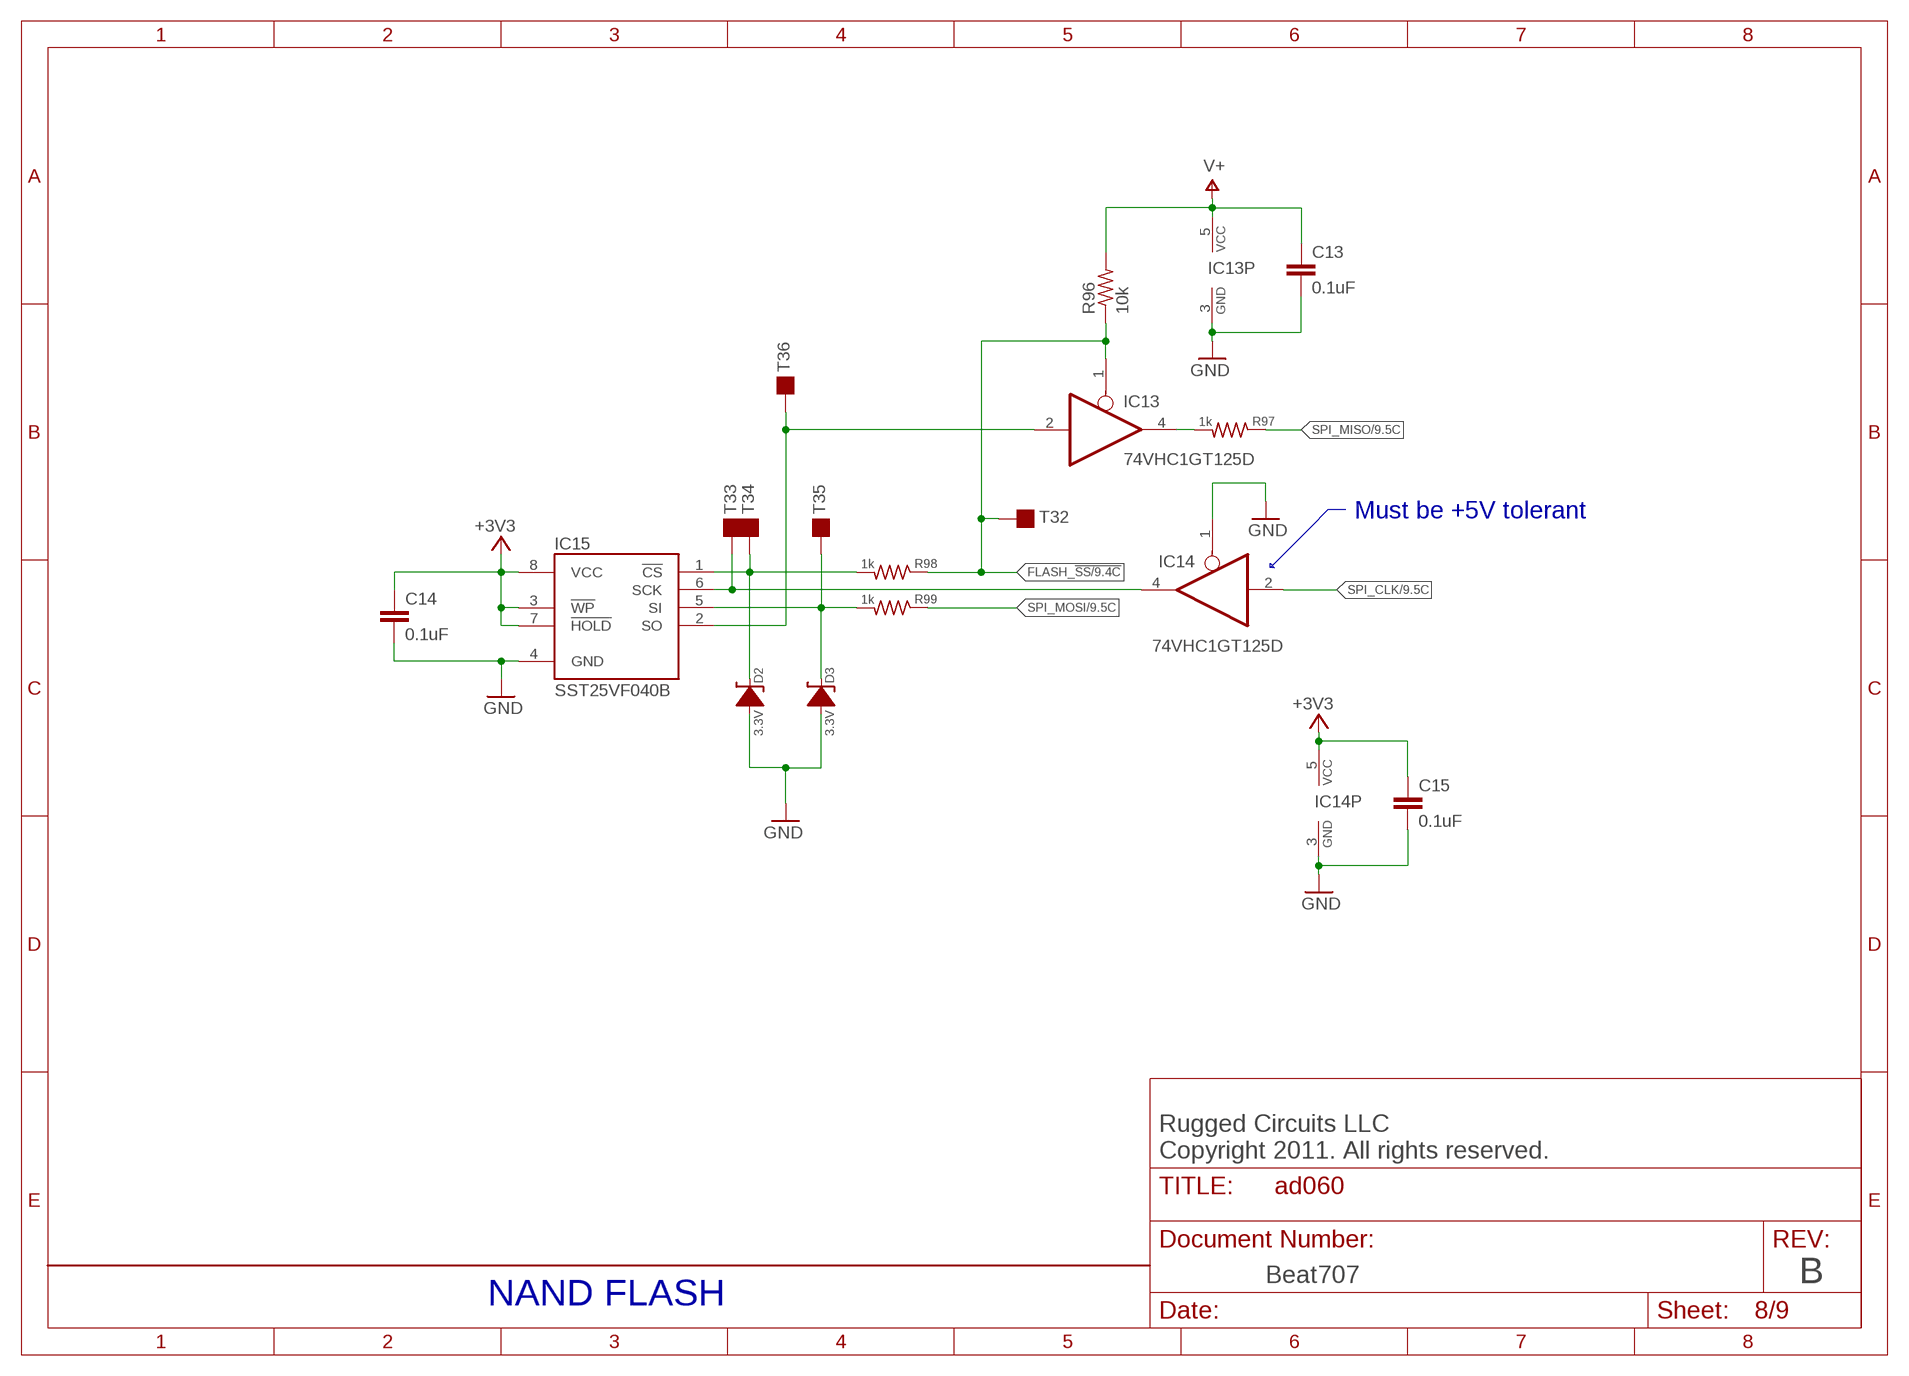
[diagram p7: schematic, sheet 8]

### Parts
C13  0.1uF  C-EUC0805  [C0805]
C14  0.1uF  C-EUC0805  [C0805]
C15  0.1uF  C-EUC0805  [C0805]
D2  3.3V  ZENERSOT23_13  [SOT-23]
D3  3.3V  ZENERSOT23_13  [SOT-23]
IC13  74VHC1GT125D  74LVC1G125DBV  [SOT23-5]
IC14  74VHC1GT125D  74LVC1G125DBV  [SOT23-5]
IC15  SST25VF040B  AT26F004-SSU  [SO08]
R96  10k  R-US_R0805  [R0805]
R97  1k  R-US_R0805  [R0805]
R98  1k  R-US_R0805  [R0805]
R99  1k  R-US_R0805  [R0805]
T32  TESTPOINT40  [TP40MIL]
T33  TESTPOINT40  [TP40MIL]
T34  TESTPOINT40  [TP40MIL]
T35  TESTPOINT40  [TP40MIL]
T36  TESTPOINT40  [TP40MIL]

### Nets
+3V3: C14.1 C15.1 IC14.5(VCC) IC15.3(!WP) IC15.7(!HOLD) IC15.8(VCC) ; also sheet 7,9
FLASH_!SS: IC13.1(OE) R96.1 R98.1 T32.1 ; also sheet 9
GND: C13.2 C14.2 C15.2 D2.1(A) D3.1(A) IC13.3(GND) IC14.1(OE) IC14.3(GND) IC15.4(GND) ; also sheet 1,2,3,4,5,6,7,9
N$10: IC13.4(O) R97.2
N$152: IC14.4(O) IC15.6(SCK) T33.1
N$154: IC13.2(I) IC15.2(SO) T36.1
N$162: D3.3(C) IC15.5(SI) R99.2 T35.1
N$163: D2.3(C) IC15.1(!CS) R98.2 T34.1
SPI_CLK: IC14.2(I) ; also sheet 1,2,3,7,9
SPI_MISO: R97.1 ; also sheet 3,7,9
SPI_MOSI: R99.1 ; also sheet 1,7,9
V+: C13.1 IC13.5(VCC) R96.2 ; also sheet 1,2,3,4,6,7,9

### Notes on the sheet
- Must be +5V tolerant
- Rugged Circuits LLC
- NAND FLASH

## Sheet 9 of 9
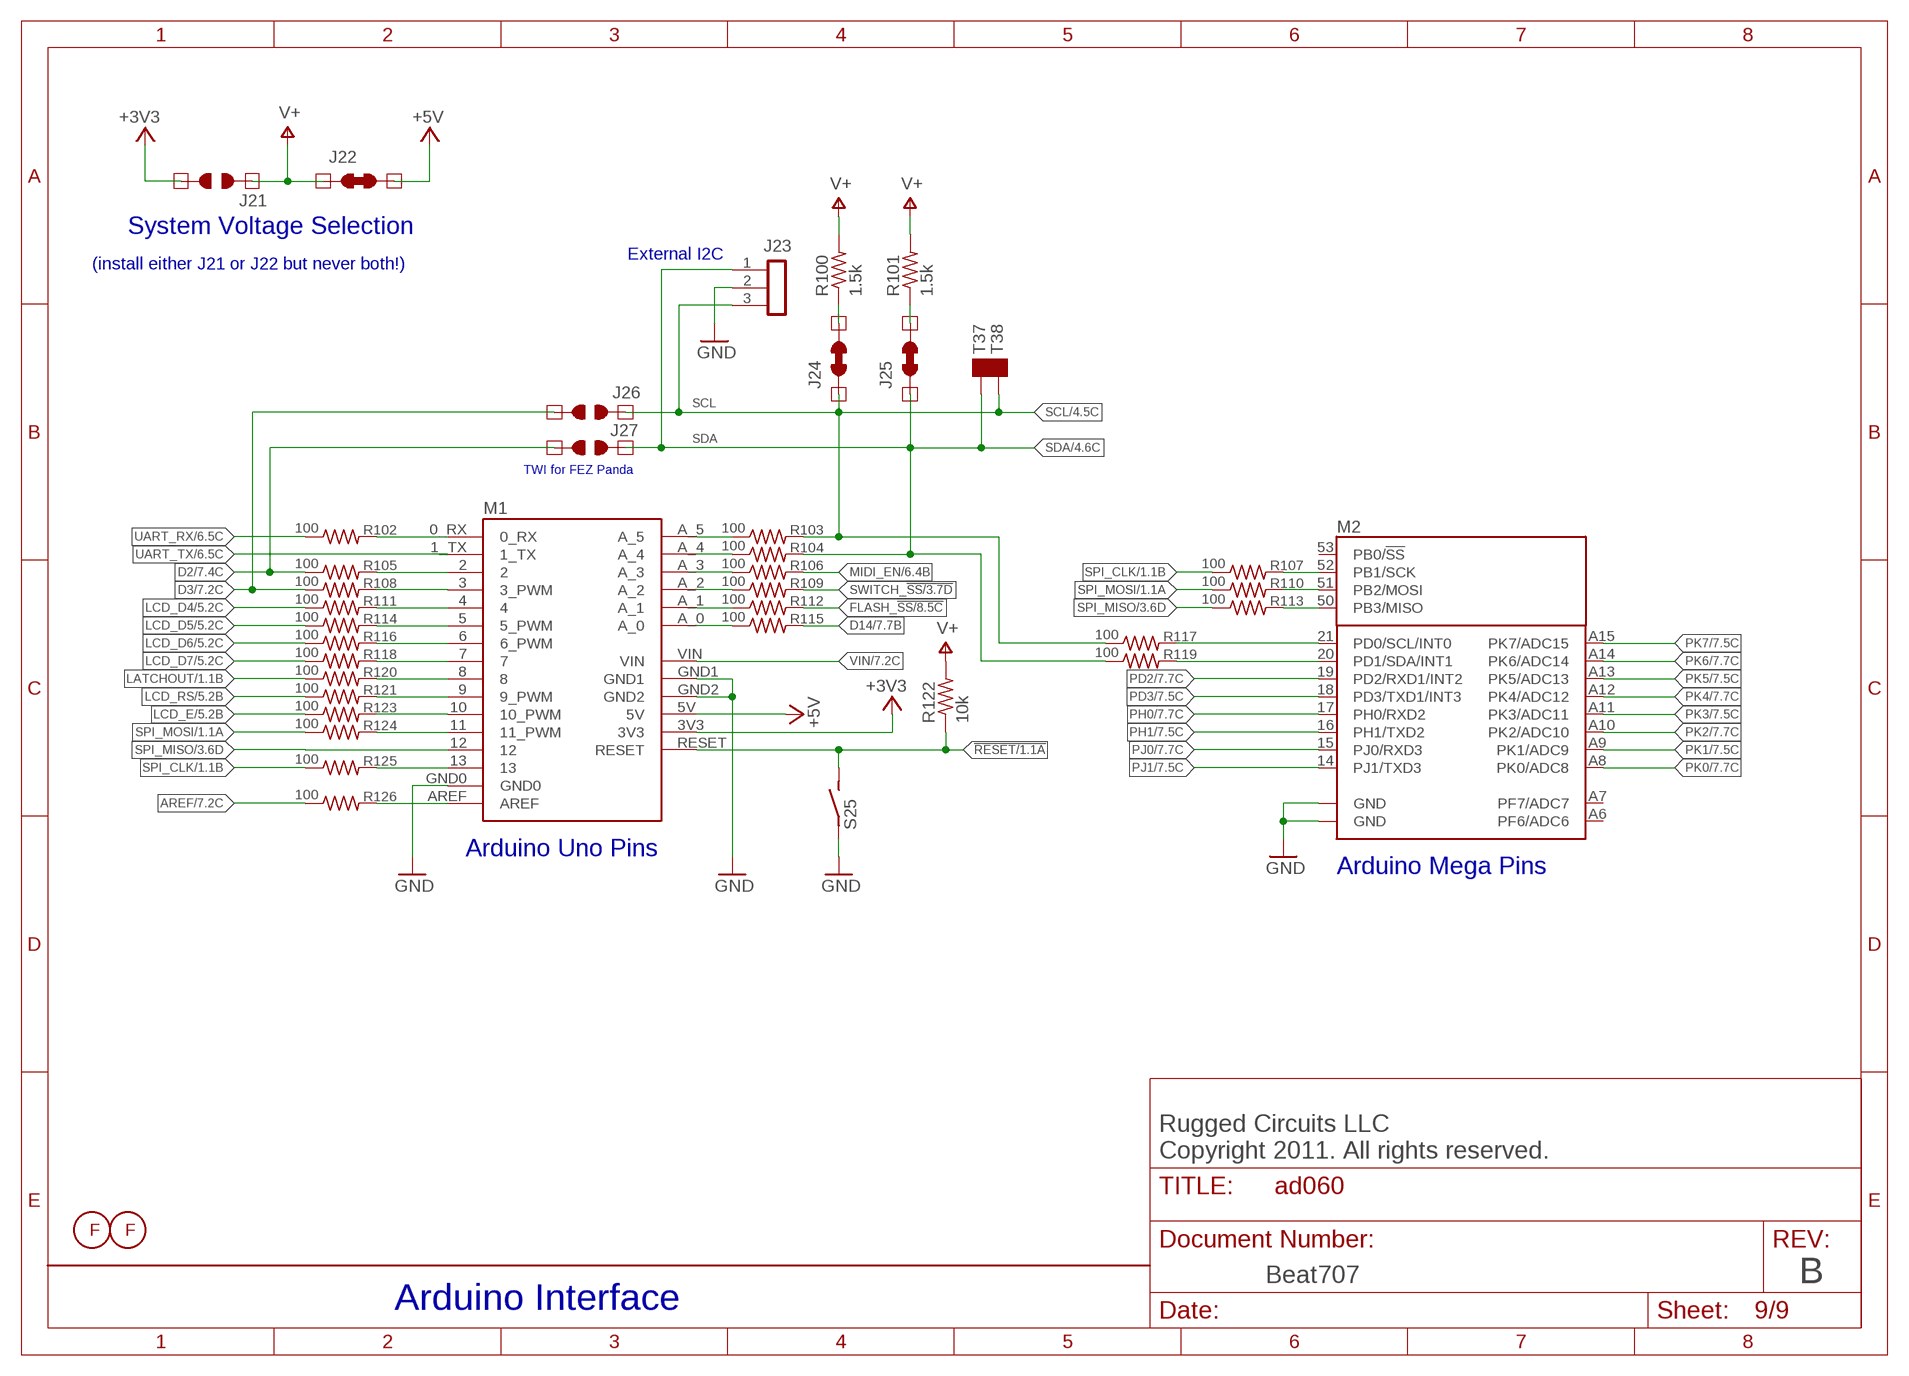
[diagram p8: schematic, sheet 9]

### Parts
FM1  FIDUCIAL2MMCIRCLE  [FIDUCIAL_2MMCIRCLE]
FM2  FIDUCIAL2MMCIRCLE  [FIDUCIAL_2MMCIRCLE]
J21  JP2NO  [JP2NO]
J22  JP2NC  [JP2NC]
J23  CON3P1R.GC22232031  [GC22232031]
J24  JP2NC  [JP2NC]
J25  JP2NC  [JP2NC]
J26  JP2NO  [JP2NO]
J27  JP2NO  [JP2NO]
M1  Arduino UNO  ARDUINO-USB  [SHIELD-NOTEXT-OCTAGONALPAD]
M2  MEGA-EXTRAPINS-SPIONLY  [MEGA-EXTRAPINS-SPIONLY]
R100  1.5k  R-US_R0805  [R0805]
R101  1.5k  R-US_R0805  [R0805]
R102  100  R-US_R0805  [R0805]
R103  100  R-US_R0805  [R0805]
R104  100  R-US_R0805  [R0805]
R105  100  R-US_R0805  [R0805]
R106  100  R-US_R0805  [R0805]
R107  100  R-US_R0805  [R0805]
R108  100  R-US_R0805  [R0805]
R109  100  R-US_R0805  [R0805]
R110  100  R-US_R0805  [R0805]
R111  100  R-US_R0805  [R0805]
R112  100  R-US_R0805  [R0805]
R113  100  R-US_R0805  [R0805]
R114  100  R-US_R0805  [R0805]
R115  100  R-US_R0805  [R0805]
R116  100  R-US_R0805  [R0805]
R117  100  R-US_R0805  [R0805]
R118  100  R-US_R0805  [R0805]
R119  100  R-US_R0805  [R0805]
R120  100  R-US_R0805  [R0805]
R121  100  R-US_R0805  [R0805]
R122  10k  R-US_R0805  [R0805]
R123  100  R-US_R0805  [R0805]
R124  100  R-US_R0805  [R0805]
R125  100  R-US_R0805  [R0805]
R126  100  R-US_R0805  [R0805]
S25  EVQPJ  [EVQPJ]
T37  TESTPOINT40  [TP40MIL]
T38  TESTPOINT40  [TP40MIL]

### Nets
!RESET: M1.RESET R122.1 S25.B ; also sheet 1,7
+3V3: J21.1 M1.3V3 ; also sheet 7,8
+5V: J22.2 M1.5V ; also sheet 1,5,7
AREF: R126.1 ; also sheet 7
D2: J27.1 R105.1 ; also sheet 7
D3: J26.1 R108.1 ; also sheet 7
D14: R115.2 ; also sheet 7
FLASH_!SS: R112.2 ; also sheet 8
GND: J23.2 M1.GND0 M1.GND1 M1.GND2 M2.GND@1(GND) M2.GND@2(GND) S25.A ; also sheet 1,2,3,4,5,6,7,8
LATCHOUT: R120.1 ; also sheet 1,2,3
LCD_D4: R111.1 ; also sheet 5
LCD_D5: R114.1 ; also sheet 5
LCD_D6: R116.1 ; also sheet 5
LCD_D7: R118.1 ; also sheet 5
LCD_E: R123.1 ; also sheet 5
LCD_RS: R121.1 ; also sheet 5
MIDI_EN: R106.2 ; also sheet 6
N$2: M2.50(PB3/MISO) R113.2
N$11: M1.11(11_PWM) R124.2
N$13: M1.13 R125.2
N$15: M2.51(PB2/MOSI) R110.2
N$18: M1.4 R111.2
N$19: M1.6(6_PWM) R116.2
N$21: M1.5(5_PWM) R114.2
N$23: M1.7 R118.2
N$25: M1.8 R120.2
N$27: M1.A_1 R112.1
N$29: M1.A_0 R115.1
N$132: M1.0_RX R102.2
N$133: M1.A_3 R106.1
N$134: M1.A_2 R109.1
N$139: M1.9(9_PWM) R121.2
N$140: M1.10(10_PWM) R123.2
N$141: J24.2 R100.1
N$142: J25.2 R101.1
N$143: M2.21(PD0/SCL/INT0) R117.2
N$144: M1.AREF R126.2
N$145: M2.20(PD1/SDA/INT1) R119.2
N$146: M1.A_4 R104.1
N$147: M1.A_5 R103.1
N$148: M1.2 R105.2
N$149: M1.3(3_PWM) R108.2
N$150: M2.52(PB1/SCK) R107.2
PD2: M2.19(PD2/RXD1/INT2) ; also sheet 7
PD3: M2.18(PD3/TXD1/INT3) ; also sheet 7
PH0: M2.17(PH0/RXD2) ; also sheet 7
PH1: M2.16(PH1/TXD2) ; also sheet 7
PJ0: M2.15(PJ0/RXD3) ; also sheet 7
PJ1: M2.14(PJ1/TXD3) ; also sheet 7
PK0: M2.A8(PK0/ADC8) ; also sheet 7
PK1: M2.A9(PK1/ADC9) ; also sheet 7
PK2: M2.A10(PK2/ADC10) ; also sheet 7
PK3: M2.A11(PK3/ADC11) ; also sheet 7
PK4: M2.A12(PK4/ADC12) ; also sheet 7
PK5: M2.A13(PK5/ADC13) ; also sheet 7
PK6: M2.A14(PK6/ADC14) ; also sheet 7
PK7: M2.A15(PK7/ADC15) ; also sheet 7
SCL: J23.3 J24.1 J26.2 R103.2 R117.1 T38.1 ; also sheet 4,7
SDA: J23.1 J25.1 J27.2 R104.2 R119.1 T37.1 ; also sheet 4,7
SPI_CLK: R107.1 R125.1 ; also sheet 1,2,3,7,8
SPI_MISO: M1.12 R113.1 ; also sheet 3,7,8
SPI_MOSI: R110.1 R124.1 ; also sheet 1,7,8
SWITCH_!SS: R109.2 ; also sheet 3
UART_RX: R102.1 ; also sheet 6,7
UART_TX: M1.1_TX ; also sheet 6,7
V+: J21.2 J22.1 R100.2 R101.2 R122.2 ; also sheet 1,2,3,4,6,7,8
VIN: M1.VIN ; also sheet 7
Unconnected: M2.53(PB0/!SS) M2.A6(PF6/ADC6) M2.A7(PF7/ADC7)

### Notes on the sheet
- System Voltage Selection
- External I2C
- (install either J21 or J22 but never both!)
- TWI for FEZ Panda
- Arduino Uno Pins
- Arduino Mega Pins
- Rugged Circuits LLC
- Arduino Interface

## Library data of the parts
C1-C15 = rcl:C-EU: CAPACITOR, European symbol
D1 = Magnum:DIODE: Diode
D2 D3 = ads4:ZENER: Zener Diode
FM1 FM2 = pickplace:FIDUCIAL: Fiducial marks
IC1 IC2 = 74xx-eu:74*595: 8-bit SHIFT REGISTER, output latch
IC3-IC6 = 74xx-eu:74*165: 8-bit parallel load SHIFT REGISTER
IC7 = 74xx-eu:74*125: Quad bus BUFFER, 3-state
IC8-IC11 = microchip:24*: Serial EEPROM I2C; MF: MICROCHIP; MPN: 24LC256-I/SN; OC_FARNELL: 9757996; OC_NEWARK: 27C9144
IC12 = ads4:OPTOISOLATOR: 4-pin Optoisolator
IC13 IC14 = 74xx-little-us:74*1G125: Single Bus Buffer Gate with 3-State Output
IC15 = ads4:AT26F004: Atmel AT26F004 4M serial FLASH
J1-J13 J15 J17 J18 J21 J26 J27 = JUMPERS:JP2NO: Normally-open 2-pin jumper with copper shunt
J14 J16 J19 J20 J22 J24 J25 = JUMPERS:JP2NC: Normally-closed two-pin jumper with copper shunt
J23 = ads4:CON3P1R: 3-Pin Single-Row Header Strip
LED1-LED16 = Magnum:LED: LED
M1 = Arduino-Various:ARDUINO-USB: The Ardiuno Duemilanove Pinouts layoutet as a Bare Shield. v0.5 Also for Arduino Diecimila. This is designed as a Part and has no Outline in the Dimension Layer. The Outline, when present, is drawed at the tPlace / bPlace Layer. Library by Stephanie Lange, http://www.k-ita.de/~sl/
M2 = Arduino-Various:MEGA-EXTRAPINS-SPIONLY: Extra pins for Arduino Mega but only SPI+GND pins from far-end dual-row connector
R1-R32 R67-R83 R85 R87-R126 = rcl:R-US_: RESISTOR, American symbol
R33-R66 = adafruit:R-US_: RESISTOR, American symbol
R84 R86 = Panasonic.Pots:POT: 3-terminal potentiometer
S1-S24 = ESwitch:SPST2CONTACT: SPST Switch
S25 = ADS:EVQPJ
SV1-SV4 = con-lstb:MA04-2: PIN HEADER; OC_FARNELL: unknown; OC_NEWARK: unknown
T1-T16 T18 = transistor:*-NPN-: NPN Transistror BF959 corrected 2008.03.06
T17 = transistor:*-PNP-: PNP Transistror
T19-T38 = ads4:TESTPOINT: Test point
X1 = adafruit:HD44780LCD: HD44780 LCD Standard character type LCDs, available in sizes from 8x1 to 40x4!
X2 X3 = CUI:SDS-50J: Female CONNECTOR 5 pins 90 deg. with shield, horizontal (DIN 41524)

## Net classes
0 default: width 0.178 mm, drill 0.381 mm, clearance 0.178 mm